# Altium project 724452_RPL-HX_Mobile_AEP_Rev0p91.PrjPcb (part 9 of 13)

## Sheet 0062_HDMI0_CONNECTOR .SchDoc
size A3
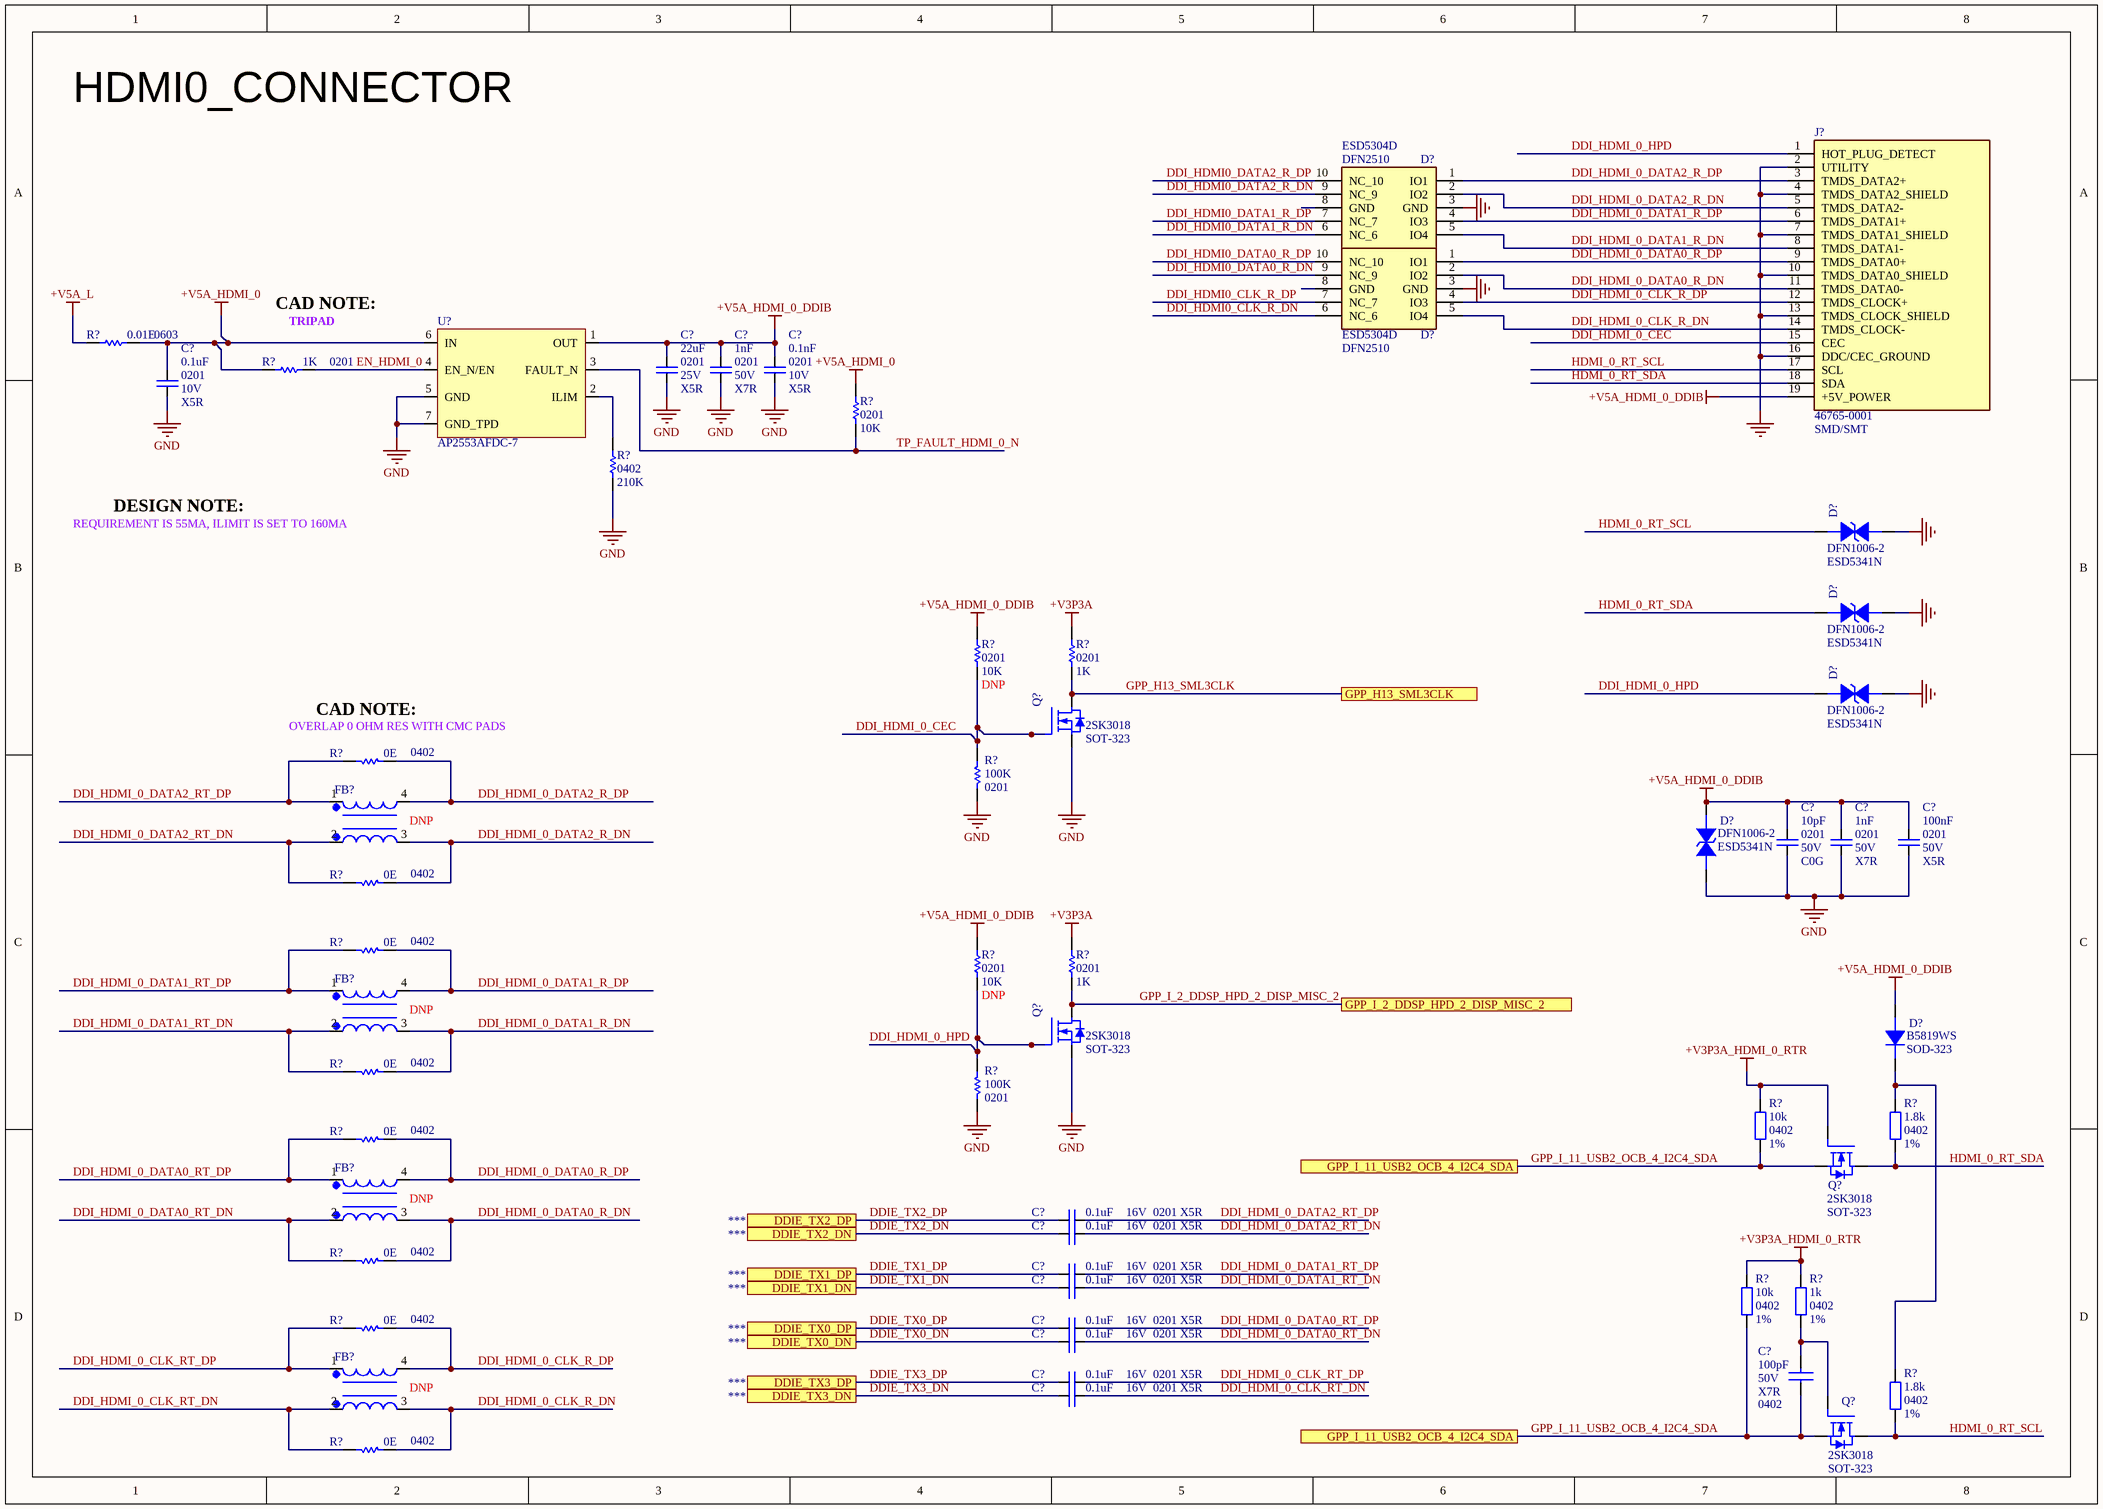
[diagram p102: 0062_HDMI0_CONNECTOR .SchDoc]

### Parts
(Parts that share a designator on the sheet are numbered #1, #2 ... from top to bottom, then left to right.)
C?#163  value 22uF  Case/Package: 0201  Voltage: 25V  Dielectric: X5R  [CAPC0805]
C?#164  value 1nF  Case/Package: 0201  Voltage: 50V  Dielectric: X7R  [CAPC0201]
C?#165  value 0.1nF  Case/Package: 0201  Voltage: 10V  Dielectric: X5R  [CAPC0201]
C?#166  value 0.1uF  Case/Package: 0201  Voltage: 10V  Dielectric: X5R  [CAPC0201]
C?#167  value 10pF  Case/Package: 0201  Voltage: 50V  Dielectric: C0G  [CAPC0201]
C?#168  value 1nF  Case/Package: 0201  Voltage: 50V  Dielectric: X7R  [CAPC0201]
C?#169  value 100nF  Case/Package: 0201  Voltage: 50V  Dielectric: X5R  [CAPC0201]
C?#170  value 0.1uF  Case/Package: 0201  Voltage: 16V  Dielectric: X5R  [CAPC0201]
C?#171  value 0.1uF  Case/Package: 0201  Voltage: 16V  Dielectric: X5R  [CAPC0201]
C?#172  value 0.1uF  Case/Package: 0201  Voltage: 16V  Dielectric: X5R  [CAPC0201]
C?#173  value 0.1uF  Case/Package: 0201  Voltage: 16V  Dielectric: X5R  [CAPC0201]
C?#174  value 0.1uF  Case/Package: 0201  Voltage: 16V  Dielectric: X5R  [CAPC0201]
C?#175  value 0.1uF  Case/Package: 0201  Voltage: 16V  Dielectric: X5R  [CAPC0201]
C?#176  value 0.1uF  Case/Package: 0201  Voltage: 16V  Dielectric: X5R  [CAPC0201]
C?#177  value 0.1uF  Case/Package: 0201  Voltage: 16V  Dielectric: X5R  [CAPC0201]
C?#178  value 100pF  Voltage: 50V  Dielectric: X7R  Case/Package: 0402  [CAPC0402]
D?#3  Case/Package: DFN2510  [DFN2510-10]  (hidden comment: ESD5304D)
D?#4  Case/Package: DFN2510  [DFN2510-10]  (hidden comment: ESD5304D)
D?#5  Case/Package: DFN1006-2  [DFN-2_1.0X0.6]  (hidden comment: ESD5341N)
D?#6  Case/Package: DFN1006-2  [DFN-2_1.0X0.6]  (hidden comment: ESD5341N)
D?#7  Case/Package: DFN1006-2  [DFN-2_1.0X0.6]  (hidden comment: ESD5341N)
D?#8  Case/Package: DFN1006-2  [DFN-2_1.0X0.6]  (hidden comment: ESD5341N)
D?#9  Manufacturer Part Number: B5819WS  [SOD-323]  (hidden comment: DIODE_B5819WS)
FB?#6  WCM3216F2SF-900T04  [CHOKE]  (value not drawn)
FB?#7  WCM3216F2SF-900T04  [CHOKE]  (value not drawn)
FB?#8  WCM3216F2SF-900T04  [CHOKE]  (value not drawn)
FB?#9  WCM3216F2SF-900T04  [CHOKE]  (value not drawn)
J?#7  Manufacturer Part Number: 46765-0001  Case/Package: SMD/SMT  [HDMI MICRO]  (hidden comment: Micro HDMI Conn)
Q?#2  Manufacturer Part Number: 2SK3018  Case/Package: SOT-323  [SOT323]  (hidden comment: MOSFET N_2SK3018)
Q?#3  Manufacturer Part Number: 2SK3018  Case/Package: SOT-323  [SOT323]  (hidden comment: MOSFET N_2SK3018)
Q?#4  Manufacturer Part Number: 2SK3018  Case/Package: SOT-323  [SOT323]  (hidden comment: MOSFET N_2SK3018)
Q?#5  Manufacturer Part Number: 2SK3018  Case/Package: SOT-323  [SOT323]  (hidden comment: MOSFET N_2SK3018)
R?#307  value 0.01E  Case/Package: 0603  [RESC0603]  (hidden comment: Res)
R?#308  value 1K  Case/Package: 0201  [RESC0201]  (hidden comment: Res)
R?#309  value 10K  Case/Package: 0201  [RESC0201]  (hidden comment: Res)
R?#310  value 210K  Case/Package: 0402  [RESC0402]  (hidden comment: Res)
R?#311  value 10K  Case/Package: 0201  [RESC0201]  (hidden comment: Res)
R?#312  value 1K  Case/Package: 0201  [RESC0201]  (hidden comment: Res)
R?#313  value 0E  Case/Package: 0402  [RESC0402]  (hidden comment: Res)
R?#314  value 100K  Case/Package: 0201  [RESC0201]  (hidden comment: Res)
R?#315  value 0E  Case/Package: 0402  [RESC0402]  (hidden comment: Res)
R?#316  value 0E  Case/Package: 0402  [RESC0402]  (hidden comment: Res)
R?#317  value 10K  Case/Package: 0201  [RESC0201]  (hidden comment: Res)
R?#318  value 1K  Case/Package: 0201  [RESC0201]  (hidden comment: Res)
R?#319  value 0E  Case/Package: 0402  [RESC0402]  (hidden comment: Res)
R?#320  value 100K  Case/Package: 0201  [RESC0201]  (hidden comment: Res)
R?#321  value 10k  Case/Package: 0402  Tolerance: 1%  [RESC0402]
R?#322  value 1.8k  Case/Package: 0402  Tolerance: 1%  [RESC0402]
R?#323  value 0E  Case/Package: 0402  [RESC0402]  (hidden comment: Res)
R?#324  value 0E  Case/Package: 0402  [RESC0402]  (hidden comment: Res)
R?#325  value 10k  Case/Package: 0402  Tolerance: 1%  [RESC0402]
R?#326  value 1k  Case/Package: 0402  Tolerance: 1%  [RESC0402]
R?#327  value 0E  Case/Package: 0402  [RESC0402]  (hidden comment: Res)
R?#328  value 1.8k  Case/Package: 0402  Tolerance: 1%  [RESC0402]
R?#329  value 0E  Case/Package: 0402  [RESC0402]  (hidden comment: Res)
U?#5  AP2553AFDC-7

### Ports
DDIE_TX0_DN, DDIE_TX0_DP, DDIE_TX1_DN, DDIE_TX1_DP, DDIE_TX2_DN, DDIE_TX2_DP, DDIE_TX3_DN, DDIE_TX3_DP, GPP_H13_SML3CLK, GPP_I_2_DDSP_HPD_2_DISP_MISC_2, GPP_I_11_USB2_OCB_4_I2C4_SDA

### Nets
+V3P3A: R?#312.2 R?#318.2
+V3P3A_HDMI_0_RTR: Q?#4.1(GATE) R?#321.2 R?#325.2 R?#326.2
+V5A_HDMI_0: C?#166.2 R?#307.1 R?#308.2 R?#309.2 U?#5.6(IN)
+V5A_HDMI_0_DDIB: C?#163.1 C?#164.1 C?#165.1 C?#167.1 C?#168.1 C?#169.1 D?#8.2 D?#9.1(A) J?#7.19(+5V_POWER) R?#311.2 R?#317.2 U?#5.1(OUT)
+V5A_L: R?#307.2
GND: C?#163.2 C?#164.2 C?#165.2 C?#166.1 C?#167.2 C?#168.2 C?#169.2 D?#3.3(GND) D?#4.3(GND) D?#5.1 D?#6.1 D?#7.1 D?#8.1 J?#7.2(UTILITY) J?#7.4(TMDS_DATA2_SHIELD) J?#7.7(TMDS_DATA1_SHIELD) J?#7.10(TMDS_DATA0_SHIELD) J?#7.13(TMDS_CLOCK_SHIELD) J?#7.16(DDC/CEC_GROUND) Q?#2.2(SOURCE) Q?#3.2(SOURCE) R?#310.1 R?#314.1 R?#320.1 U?#5.5(GND) U?#5.7(GND_TPD)  [project net EXP_A_RX_4_DP]
DDI_HDMI0_CLK_R_DN: D?#4.6(NC_6)
DDI_HDMI0_CLK_R_DP: D?#4.7(NC_7)
DDI_HDMI0_DATA0_R_DN: D?#4.9(NC_9)
DDI_HDMI0_DATA0_R_DP: D?#4.10(NC_10)
DDI_HDMI0_DATA1_R_DN: D?#3.6(NC_6)
DDI_HDMI0_DATA1_R_DP: D?#3.7(NC_7)
DDI_HDMI0_DATA2_R_DN: D?#3.9(NC_9)
DDI_HDMI0_DATA2_R_DP: D?#3.10(NC_10)
DDI_HDMI_0_CEC: J?#7.15(CEC) Q?#2.1(GATE) R?#311.1 R?#314.2
DDI_HDMI_0_CLK_R_DN: D?#4.5(IO4) FB?#9.3 J?#7.14(TMDS_CLOCK-) R?#329.2
DDI_HDMI_0_CLK_R_DP: D?#4.4(IO3) FB?#9.4 J?#7.12(TMDS_CLOCK+) R?#327.2
DDI_HDMI_0_CLK_RT_DN: C?#177.2 FB?#9.2 R?#329.1
DDI_HDMI_0_CLK_RT_DP: C?#176.2 FB?#9.1 R?#327.1
DDI_HDMI_0_DATA0_R_DN: D?#4.2(IO2) FB?#8.3 J?#7.11(TMDS_DATA0-) R?#324.2
DDI_HDMI_0_DATA0_R_DP: D?#4.1(IO1) FB?#8.4 J?#7.9(TMDS_DATA0+) R?#323.2
DDI_HDMI_0_DATA0_RT_DN: C?#175.2 FB?#8.2 R?#324.1
DDI_HDMI_0_DATA0_RT_DP: C?#174.2 FB?#8.1 R?#323.1
DDI_HDMI_0_DATA1_R_DN: D?#3.5(IO4) FB?#7.3 J?#7.8(TMDS_DATA1-) R?#319.2
DDI_HDMI_0_DATA1_R_DP: D?#3.4(IO3) FB?#7.4 J?#7.6(TMDS_DATA1+) R?#316.2
DDI_HDMI_0_DATA1_RT_DN: C?#173.2 FB?#7.2 R?#319.1
DDI_HDMI_0_DATA1_RT_DP: C?#172.2 FB?#7.1 R?#316.1
DDI_HDMI_0_DATA2_R_DN: D?#3.2(IO2) FB?#6.3 J?#7.5(TMDS_DATA2-) R?#315.2
DDI_HDMI_0_DATA2_R_DP: D?#3.1(IO1) FB?#6.4 J?#7.3(TMDS_DATA2+) R?#313.2
DDI_HDMI_0_DATA2_RT_DN: C?#171.2 FB?#6.2 R?#315.1
DDI_HDMI_0_DATA2_RT_DP: C?#170.2 FB?#6.1 R?#313.1
DDI_HDMI_0_HPD: D?#7.2 J?#7.1(HOT_PLUG_DETECT) Q?#3.1(GATE) R?#317.1 R?#320.2
DDIE_TX0_DN: C?#175.1 ; port DDIE_TX0_DN
DDIE_TX0_DP: C?#174.1 ; port DDIE_TX0_DP
DDIE_TX1_DN: C?#173.1 ; port DDIE_TX1_DN
DDIE_TX1_DP: C?#172.1 ; port DDIE_TX1_DP
DDIE_TX2_DN: C?#171.1 ; port DDIE_TX2_DN
DDIE_TX2_DP: C?#170.1 ; port DDIE_TX2_DP
DDIE_TX3_DN: C?#177.1 ; port DDIE_TX3_DN
DDIE_TX3_DP: C?#176.1 ; port DDIE_TX3_DP
EN_HDMI_0: R?#308.1 U?#5.4(EN_N/EN)
GPP_H13_SML3CLK: Q?#2.3(DRAIN) R?#312.1 ; port GPP_H13_SML3CLK
GPP_I_2_DDSP_HPD_2_DISP_MISC_2: Q?#3.3(DRAIN) R?#318.1 ; port GPP_I_2_DDSP_HPD_2_DISP_MISC_2
GPP_I_11_USB2_OCB_4_I2C4_SDA: C?#178.1 Q?#4.2(SOURCE) Q?#5.2(SOURCE) R?#321.1 R?#325.1 ; port GPP_I_11_USB2_OCB_4_I2C4_SDA
HDMI_0_RT_SCL: D?#5.2 J?#7.17(SCL) Q?#5.3(DRAIN) R?#328.1
HDMI_0_RT_SDA: D?#6.2 J?#7.18(SDA) Q?#4.3(DRAIN) R?#322.1
TP_FAULT_HDMI_0_N: R?#309.1 U?#5.3(FAULT_N)
NetC?#178_2: C?#178.2 Q?#5.1(GATE) R?#326.1
NetD?#9_2: D?#9.2(K) R?#322.2 R?#328.2
NetR?#310_2: R?#310.2 U?#5.2(ILIM)

Not connected (* = marked no-connect by the designer): D?#3 8(GND); D?#4 8(GND)

### Notes on the sheet
- HDMI0_CONNECTOR
- CAD NOTE:
- (near R?#308) TRIPAD
- DESIGN NOTE:
- REQUIREMENT IS 55MA, ILIMIT IS SET TO 160MA
- (near R?#313) CAD NOTE:
- (near R?#313) OVERLAP 0 OHM RES WITH CMC PADS

### Library data of the parts
C?#163 = Cap: CAP CER 22uF 25V X5R 0805
C?#164 C?#168 = Cap: CAP CER 1nF 50V X7R 0201
C?#165 = Cap: CAP CER 0.1nF 10V X5R 0201
C?#166 = Cap: CAP CER 0.1uF 10V X5R 0201
C?#167 = Cap: CAP CER 10pF 50V C0G 0201
C?#169 = Cap: CAP CER 100nF 50V X5R 0201
C?#170-C?#177 = Cap: CAP CER 0.1uF 16V X5R 0201
C?#178 = Cap: CAP CER 100pF 50V X7R 0402; Manufacturer Part Number: *
D?#3 D?#4 = ESD5304D: 4-Lines, Uni-directional, Ultra-low Capacitance Transient Voltage Suppressors; Manufacturer Part Number: ESD5304D
D?#5-D?#8 = ESD5341N: 1-Line, Bi-directional, Transient Voltage Suppressors.1pF.; Manufacturer Part Number: ESD5341N
D?#9 = DIODE_B5819WS: Schottky Barrier£¬B5819WS SOD-323; Case/Package: SOD-323
FB?#6-FB?#9 = WCM3216F2SF-900T04: Power, Signal Line 90 Ohms @ 100MHz 300 mOhm 50V SMD,3.2x1.6x2mm Common Mode Filters RoHS; Manufacturer Part Number: WCM3216F2SF-900T04; Case/Package: 3.2x1.6x2mm; DNP: DNP
J?#7 = Micro HDMI Conn: HDMI - Micro Receptacle Connector 19 Position Surface Mount, Right Angle
Q?#2-Q?#5 = MOSFET N_2SK3018: NMOS,2SK3018,SOT_323,Id=0.1A,Vds=30V
R?#307 = Res: Thick Film Resistor -  0.01ohm, 1%, 0603
R?#308 R?#312 R?#318 = Res: Thick Film Resistor -  1Kohm, 1%, 0201
R?#309 R?#311 R?#317 = Res: Thick Film Resistor -  10Kohm, 1%, 0201
  R?#311 R?#317: DNP: DNP
R?#310 = Res: Thick Film Resistor -  210Kohm, 1%, 0402
R?#313 R?#315 R?#316 R?#319 R?#323 R?#324 R?#327 R?#329 = Res: Thick Film Resistor -  0ohm, 1%, 0402
R?#314 R?#320 = Res: Thick Film Resistor -  100Kohm, 1%, 0201
R?#321 R?#325 = RES: Thick Film Resistor - 10k ohm, 1%, 0402; Manufacturer Part Number: *
R?#322 R?#328 = RES: Thick Film Resistor - 1.8k ohm, 1%, 0402; Manufacturer Part Number: *
R?#326 = RES: Thick Film Resistor - 1k ohm, 1%, 0402; Manufacturer Part Number: *

## Sheet 0063_HDMI1_CONNECTOR.SchDoc
size A3
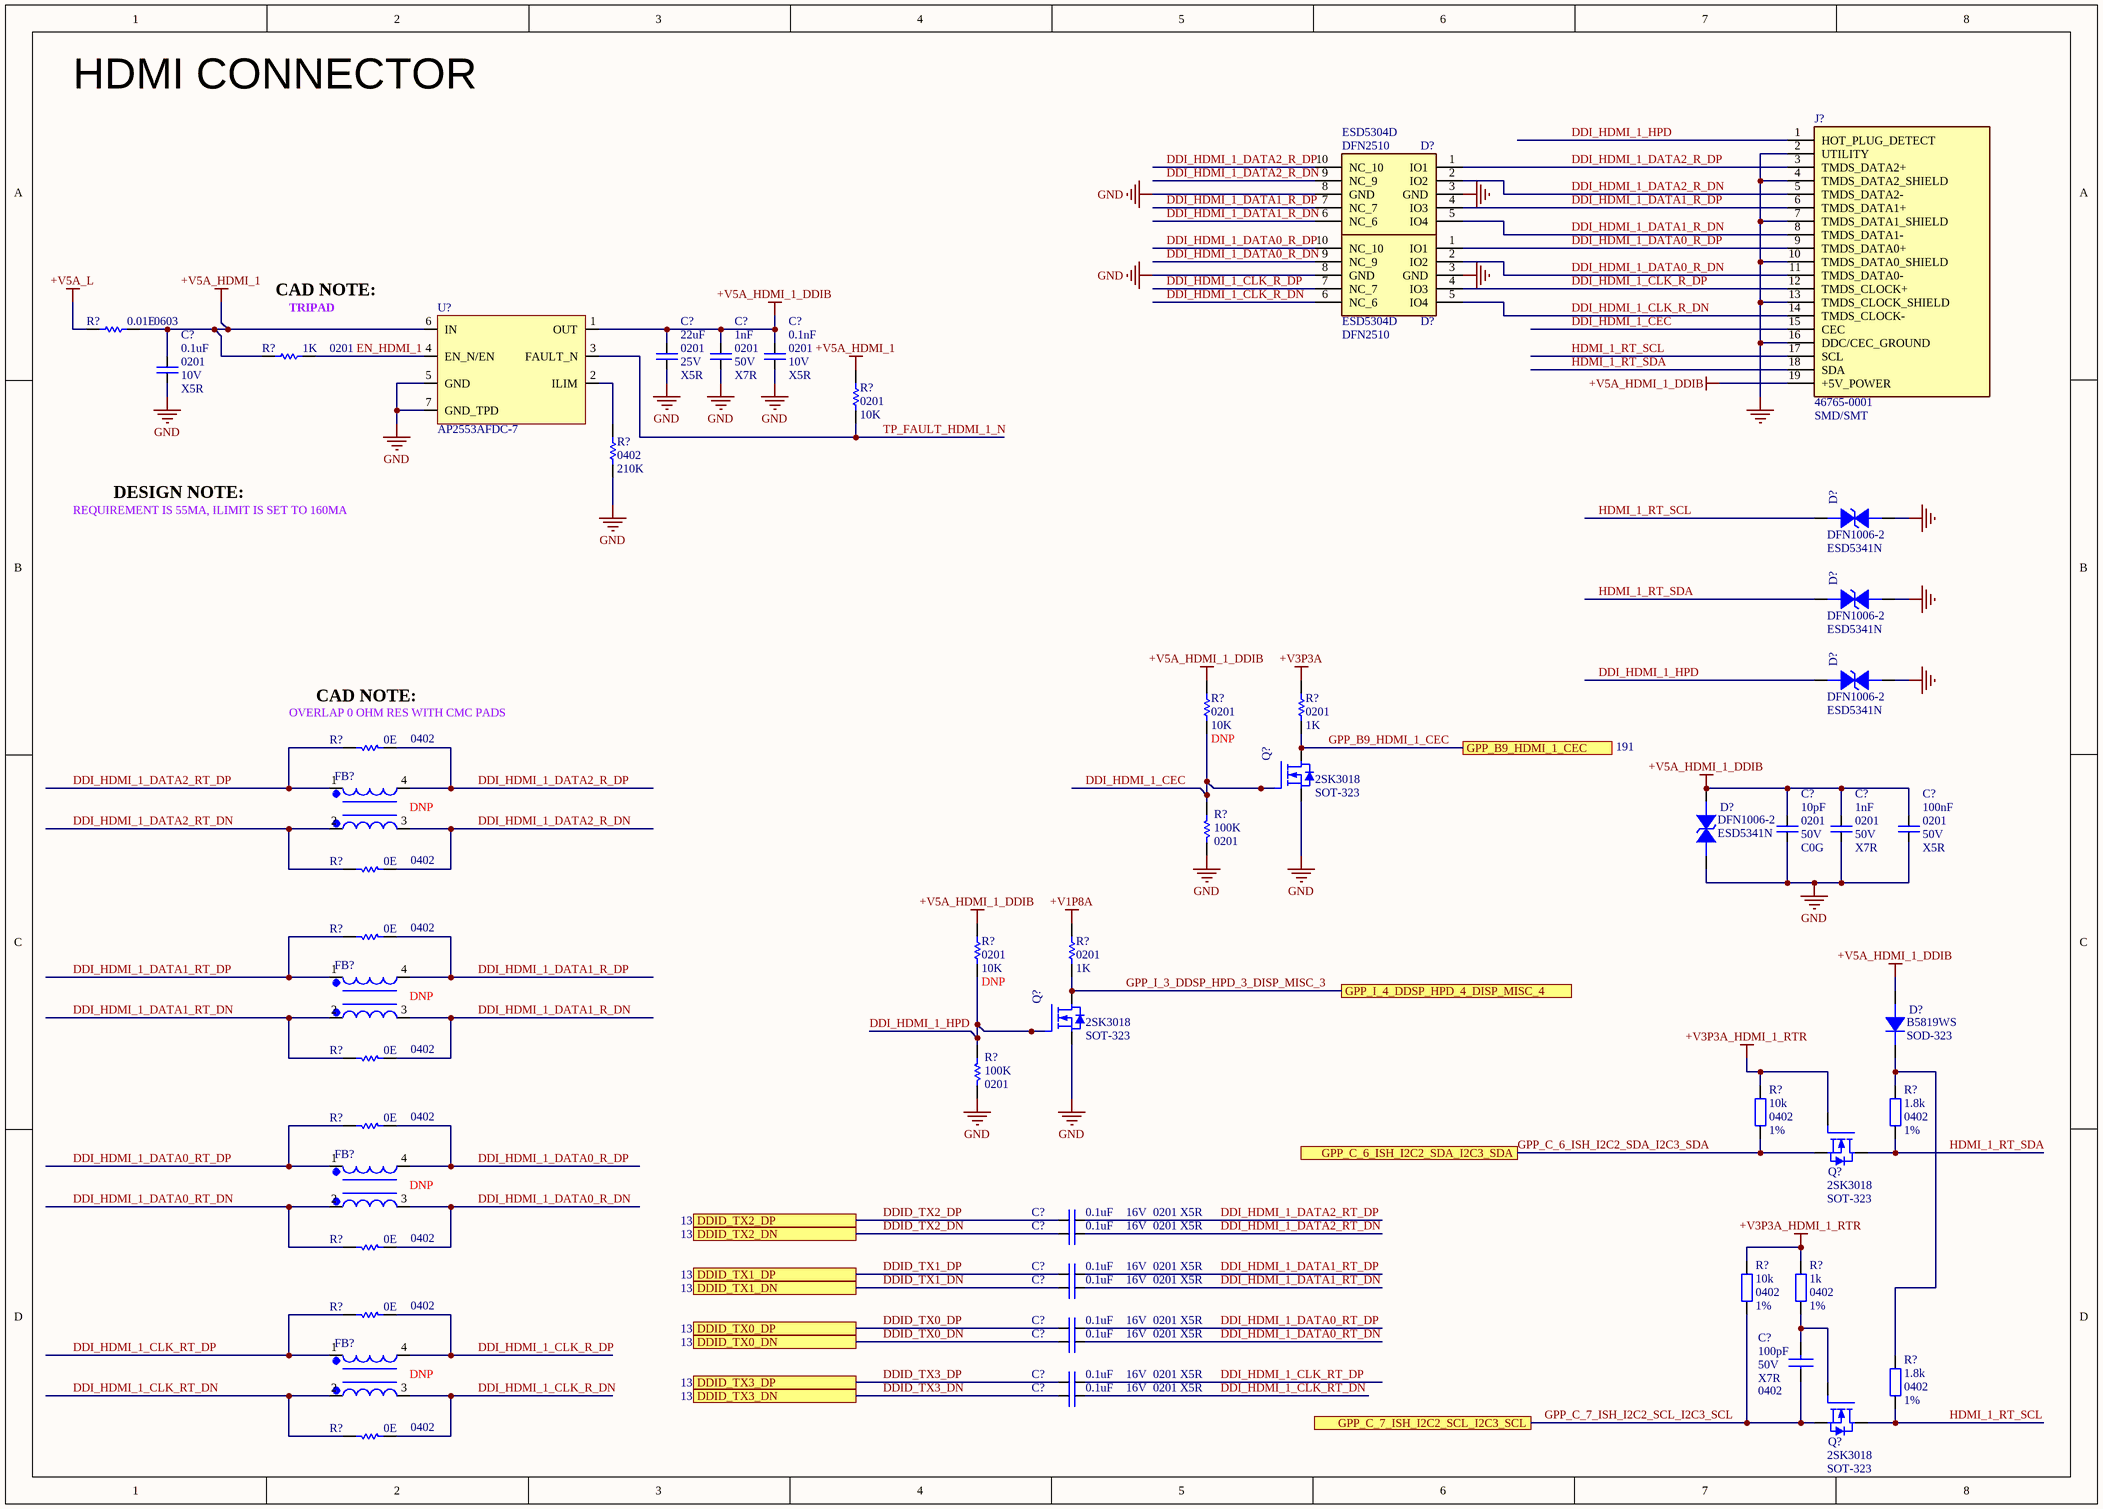
[diagram p103: 0063_HDMI1_CONNECTOR.SchDoc]

### Parts
(Parts that share a designator on the sheet are numbered #1, #2 ... from top to bottom, then left to right.)
C?#179  value 22uF  Case/Package: 0201  Voltage: 25V  Dielectric: X5R  [CAPC0805]
C?#180  value 1nF  Case/Package: 0201  Voltage: 50V  Dielectric: X7R  [CAPC0201]
C?#181  value 0.1nF  Case/Package: 0201  Voltage: 10V  Dielectric: X5R  [CAPC0201]
C?#182  value 0.1uF  Case/Package: 0201  Voltage: 10V  Dielectric: X5R  [CAPC0201]
C?#183  value 10pF  Case/Package: 0201  Voltage: 50V  Dielectric: C0G  [CAPC0201]
C?#184  value 1nF  Case/Package: 0201  Voltage: 50V  Dielectric: X7R  [CAPC0201]
C?#185  value 100nF  Case/Package: 0201  Voltage: 50V  Dielectric: X5R  [CAPC0201]
C?#186  value 0.1uF  Case/Package: 0201  Voltage: 16V  Dielectric: X5R  [CAPC0201]
C?#187  value 0.1uF  Case/Package: 0201  Voltage: 16V  Dielectric: X5R  [CAPC0201]
C?#188  value 0.1uF  Case/Package: 0201  Voltage: 16V  Dielectric: X5R  [CAPC0201]
C?#189  value 0.1uF  Case/Package: 0201  Voltage: 16V  Dielectric: X5R  [CAPC0201]
C?#190  value 0.1uF  Case/Package: 0201  Voltage: 16V  Dielectric: X5R  [CAPC0201]
C?#191  value 0.1uF  Case/Package: 0201  Voltage: 16V  Dielectric: X5R  [CAPC0201]
C?#192  value 0.1uF  Case/Package: 0201  Voltage: 16V  Dielectric: X5R  [CAPC0201]
C?#193  value 100pF  Voltage: 50V  Dielectric: X7R  Case/Package: 0402  [CAPC0402]
C?#194  value 0.1uF  Case/Package: 0201  Voltage: 16V  Dielectric: X5R  [CAPC0201]
D?#10  Case/Package: DFN2510  [DFN2510-10]  (hidden comment: ESD5304D)
D?#11  Case/Package: DFN2510  [DFN2510-10]  (hidden comment: ESD5304D)
D?#12  Case/Package: DFN1006-2  [DFN-2_1.0X0.6]  (hidden comment: ESD5341N)
D?#13  Case/Package: DFN1006-2  [DFN-2_1.0X0.6]  (hidden comment: ESD5341N)
D?#14  Case/Package: DFN1006-2  [DFN-2_1.0X0.6]  (hidden comment: ESD5341N)
D?#15  Case/Package: DFN1006-2  [DFN-2_1.0X0.6]  (hidden comment: ESD5341N)
D?#16  Manufacturer Part Number: B5819WS  [SOD-323]  (hidden comment: DIODE_B5819WS)
FB?#10  WCM3216F2SF-900T04  [CHOKE]  (value not drawn)
FB?#11  WCM3216F2SF-900T04  [CHOKE]  (value not drawn)
FB?#12  WCM3216F2SF-900T04  [CHOKE]  (value not drawn)
FB?#13  WCM3216F2SF-900T04  [CHOKE]  (value not drawn)
J?#8  Manufacturer Part Number: 46765-0001  Case/Package: SMD/SMT  [HDMI MICRO]  (hidden comment: Micro HDMI Conn)
Q?#6  Manufacturer Part Number: 2SK3018  Case/Package: SOT-323  [SOT323]  (hidden comment: MOSFET N_2SK3018)
Q?#7  Manufacturer Part Number: 2SK3018  Case/Package: SOT-323  [SOT323]  (hidden comment: MOSFET N_2SK3018)
Q?#8  Manufacturer Part Number: 2SK3018  Case/Package: SOT-323  [SOT323]  (hidden comment: MOSFET N_2SK3018)
Q?#9  Manufacturer Part Number: 2SK3018  Case/Package: SOT-323  [SOT323]  (hidden comment: MOSFET N_2SK3018)
R?#330  value 0.01E  Case/Package: 0603  [RESC0603]  (hidden comment: Res)
R?#331  value 1K  Case/Package: 0201  [RESC0201]  (hidden comment: Res)
R?#332  value 10K  Case/Package: 0201  [RESC0201]  (hidden comment: Res)
R?#333  value 210K  Case/Package: 0402  [RESC0402]  (hidden comment: Res)
R?#334  value 10K  Case/Package: 0201  [RESC0201]  (hidden comment: Res)
R?#335  value 1K  Case/Package: 0201  [RESC0201]  (hidden comment: Res)
R?#336  value 0E  Case/Package: 0402  [RESC0402]  (hidden comment: Res)
R?#337  value 100K  Case/Package: 0201  [RESC0201]  (hidden comment: Res)
R?#338  value 0E  Case/Package: 0402  [RESC0402]  (hidden comment: Res)
R?#339  value 0E  Case/Package: 0402  [RESC0402]  (hidden comment: Res)
R?#340  value 10K  Case/Package: 0201  [RESC0201]  (hidden comment: Res)
R?#341  value 1K  Case/Package: 0201  [RESC0201]  (hidden comment: Res)
R?#342  value 0E  Case/Package: 0402  [RESC0402]  (hidden comment: Res)
R?#343  value 100K  Case/Package: 0201  [RESC0201]  (hidden comment: Res)
R?#344  value 10k  Case/Package: 0402  Tolerance: 1%  [RESC0402]
R?#345  value 1.8k  Case/Package: 0402  Tolerance: 1%  [RESC0402]
R?#346  value 0E  Case/Package: 0402  [RESC0402]  (hidden comment: Res)
R?#347  value 0E  Case/Package: 0402  [RESC0402]  (hidden comment: Res)
R?#348  value 10k  Case/Package: 0402  Tolerance: 1%  [RESC0402]
R?#349  value 1k  Case/Package: 0402  Tolerance: 1%  [RESC0402]
R?#350  value 0E  Case/Package: 0402  [RESC0402]  (hidden comment: Res)
R?#351  value 1.8k  Case/Package: 0402  Tolerance: 1%  [RESC0402]
R?#352  value 0E  Case/Package: 0402  [RESC0402]  (hidden comment: Res)
U?#6  AP2553AFDC-7

### Ports
DDID_TX0_DN, DDID_TX0_DP, DDID_TX1_DN, DDID_TX1_DP, DDID_TX2_DN, DDID_TX2_DP, DDID_TX3_DN, DDID_TX3_DP, GPP_B9_HDMI_1_CEC, GPP_C_6_ISH_I2C2_SDA_I2C3_SDA, GPP_C_7_ISH_I2C2_SCL_I2C3_SCL, GPP_I_4_DDSP_HPD_4_DISP_MISC_4

### Nets
+V1P8A: R?#341.2
+V3P3A: R?#335.2
+V3P3A_HDMI_1_RTR: Q?#8.1(GATE) R?#344.2 R?#348.2 R?#349.2
+V5A_HDMI_1: C?#182.2 R?#330.1 R?#331.2 R?#332.2 U?#6.6(IN)
+V5A_HDMI_1_DDIB: C?#179.1 C?#180.1 C?#181.1 C?#183.1 C?#184.1 C?#185.1 D?#15.2 D?#16.1(A) J?#8.19(+5V_POWER) R?#334.2 R?#340.2 U?#6.1(OUT)
+V5A_L: R?#330.2
GND: C?#179.2 C?#180.2 C?#181.2 C?#182.1 C?#183.2 C?#184.2 C?#185.2 D?#10.3(GND) D?#10.8(GND) D?#11.3(GND) D?#11.8(GND) D?#12.1 D?#13.1 D?#14.1 D?#15.1 J?#8.2(UTILITY) J?#8.4(TMDS_DATA2_SHIELD) J?#8.7(TMDS_DATA1_SHIELD) J?#8.10(TMDS_DATA0_SHIELD) J?#8.13(TMDS_CLOCK_SHIELD) J?#8.16(DDC/CEC_GROUND) Q?#6.2(SOURCE) Q?#7.2(SOURCE) R?#333.1 R?#337.1 R?#343.1 U?#6.5(GND) U?#6.7(GND_TPD)  [project net EXP_A_RX_4_DP]
DDI_HDMI_1_CEC: J?#8.15(CEC) Q?#6.1(GATE) R?#334.1 R?#337.2
DDI_HDMI_1_CLK_R_DN: D?#11.5(IO4) D?#11.6(NC_6) FB?#13.3 J?#8.14(TMDS_CLOCK-) R?#352.2
DDI_HDMI_1_CLK_R_DP: D?#11.4(IO3) D?#11.7(NC_7) FB?#13.4 J?#8.12(TMDS_CLOCK+) R?#350.2
DDI_HDMI_1_CLK_RT_DN: C?#194.2 FB?#13.2 R?#352.1
DDI_HDMI_1_CLK_RT_DP: C?#192.2 FB?#13.1 R?#350.1
DDI_HDMI_1_DATA0_R_DN: D?#11.2(IO2) D?#11.9(NC_9) FB?#12.3 J?#8.11(TMDS_DATA0-) R?#347.2
DDI_HDMI_1_DATA0_R_DP: D?#11.1(IO1) D?#11.10(NC_10) FB?#12.4 J?#8.9(TMDS_DATA0+) R?#346.2
DDI_HDMI_1_DATA0_RT_DN: C?#191.2 FB?#12.2 R?#347.1
DDI_HDMI_1_DATA0_RT_DP: C?#190.2 FB?#12.1 R?#346.1
DDI_HDMI_1_DATA1_R_DN: D?#10.5(IO4) D?#10.6(NC_6) FB?#11.3 J?#8.8(TMDS_DATA1-) R?#342.2
DDI_HDMI_1_DATA1_R_DP: D?#10.4(IO3) D?#10.7(NC_7) FB?#11.4 J?#8.6(TMDS_DATA1+) R?#339.2
DDI_HDMI_1_DATA1_RT_DN: C?#189.2 FB?#11.2 R?#342.1
DDI_HDMI_1_DATA1_RT_DP: C?#188.2 FB?#11.1 R?#339.1
DDI_HDMI_1_DATA2_R_DN: D?#10.2(IO2) D?#10.9(NC_9) FB?#10.3 J?#8.5(TMDS_DATA2-) R?#338.2
DDI_HDMI_1_DATA2_R_DP: D?#10.1(IO1) D?#10.10(NC_10) FB?#10.4 J?#8.3(TMDS_DATA2+) R?#336.2
DDI_HDMI_1_DATA2_RT_DN: C?#187.2 FB?#10.2 R?#338.1
DDI_HDMI_1_DATA2_RT_DP: C?#186.2 FB?#10.1 R?#336.1
DDI_HDMI_1_HPD: D?#14.2 J?#8.1(HOT_PLUG_DETECT) Q?#7.1(GATE) R?#340.1 R?#343.2
DDID_TX0_DN: C?#191.1 ; port DDID_TX0_DN
DDID_TX0_DP: C?#190.1 ; port DDID_TX0_DP
DDID_TX1_DN: C?#189.1 ; port DDID_TX1_DN
DDID_TX1_DP: C?#188.1 ; port DDID_TX1_DP
DDID_TX2_DN: C?#187.1 ; port DDID_TX2_DN
DDID_TX2_DP: C?#186.1 ; port DDID_TX2_DP
DDID_TX3_DN: C?#194.1 ; port DDID_TX3_DN
DDID_TX3_DP: C?#192.1 ; port DDID_TX3_DP
EN_HDMI_1: R?#331.1 U?#6.4(EN_N/EN)
GPP_B9_HDMI_1_CEC: Q?#6.3(DRAIN) R?#335.1 ; port GPP_B9_HDMI_1_CEC
GPP_C_6_ISH_I2C2_SDA_I2C3_SDA: Q?#8.2(SOURCE) R?#344.1 ; port GPP_C_6_ISH_I2C2_SDA_I2C3_SDA
GPP_C_7_ISH_I2C2_SCL_I2C3_SCL: C?#193.1 Q?#9.2(SOURCE) R?#348.1 ; port GPP_C_7_ISH_I2C2_SCL_I2C3_SCL
GPP_I_3_DDSP_HPD_3_DISP_MISC_3: Q?#7.3(DRAIN) R?#341.1 ; port GPP_I_4_DDSP_HPD_4_DISP_MISC_4
HDMI_1_RT_SCL: D?#12.2 J?#8.17(SCL) Q?#9.3(DRAIN) R?#351.1
HDMI_1_RT_SDA: D?#13.2 J?#8.18(SDA) Q?#8.3(DRAIN) R?#345.1
TP_FAULT_HDMI_1_N: R?#332.1 U?#6.3(FAULT_N)
NetC?#193_2: C?#193.2 Q?#9.1(GATE) R?#349.1
NetD?#16_2: D?#16.2(K) R?#345.2 R?#351.2
NetR?#333_2: R?#333.2 U?#6.2(ILIM)

### Notes on the sheet
- HDMI CONNECTOR
- CAD NOTE:
- (near R?#331) TRIPAD
- REQUIREMENT IS 55MA, ILIMIT IS SET TO 160MA
- DESIGN NOTE:
- (near R?#336) OVERLAP 0 OHM RES WITH CMC PADS
- (near R?#336) CAD NOTE:

### Library data of the parts
C?#179 = Cap: CAP CER 22uF 25V X5R 0805
C?#180 C?#184 = Cap: CAP CER 1nF 50V X7R 0201
C?#181 = Cap: CAP CER 0.1nF 10V X5R 0201
C?#182 = Cap: CAP CER 0.1uF 10V X5R 0201
C?#183 = Cap: CAP CER 10pF 50V C0G 0201
C?#185 = Cap: CAP CER 100nF 50V X5R 0201
C?#186-C?#192 C?#194 = Cap: CAP CER 0.1uF 16V X5R 0201
C?#193 = Cap: CAP CER 100pF 50V X7R 0402; Manufacturer Part Number: *
D?#10 D?#11 = ESD5304D: as D?#3 on sheet 0062_HDMI0_CONNECTOR ; Manufacturer Part Number: ESD5304D
D?#12-D?#15 = ESD5341N: as D?#5 on sheet 0062_HDMI0_CONNECTOR ; Manufacturer Part Number: ESD5341N
D?#16 = DIODE_B5819WS: Schottky Barrier£¬B5819WS SOD-323; Case/Package: SOD-323
FB?#10-FB?#13 = WCM3216F2SF-900T04: as FB?#6-FB?#9 on sheet 0062_HDMI0_CONNECTOR ; Manufacturer Part Number: WCM3216F2SF-900T04; Case/Package: 3.2x1.6x2mm; DNP: DNP
J?#8 = Micro HDMI Conn: as J?#7 on sheet 0062_HDMI0_CONNECTOR 
Q?#6-Q?#9 = MOSFET N_2SK3018: NMOS,2SK3018,SOT_323,Id=0.1A,Vds=30V
R?#330 = Res: Thick Film Resistor -  0.01ohm, 1%, 0603
R?#331 R?#335 R?#341 = Res: Thick Film Resistor -  1Kohm, 1%, 0201
R?#332 R?#334 R?#340 = Res: Thick Film Resistor -  10Kohm, 1%, 0201
  R?#334 R?#340: DNP: DNP
R?#333 = Res: Thick Film Resistor -  210Kohm, 1%, 0402
R?#336 R?#338 R?#339 R?#342 R?#346 R?#347 R?#350 R?#352 = Res: Thick Film Resistor -  0ohm, 1%, 0402
R?#337 R?#343 = Res: Thick Film Resistor -  100Kohm, 1%, 0201
R?#344 R?#348 = RES: Thick Film Resistor - 10k ohm, 1%, 0402; Manufacturer Part Number: *
R?#345 R?#351 = RES: Thick Film Resistor - 1.8k ohm, 1%, 0402; Manufacturer Part Number: *
R?#349 = RES: Thick Film Resistor - 1k ohm, 1%, 0402; Manufacturer Part Number: *

## Sheet 0071_HSIO MUXING -2.SchDoc
size 848 x 558 mm
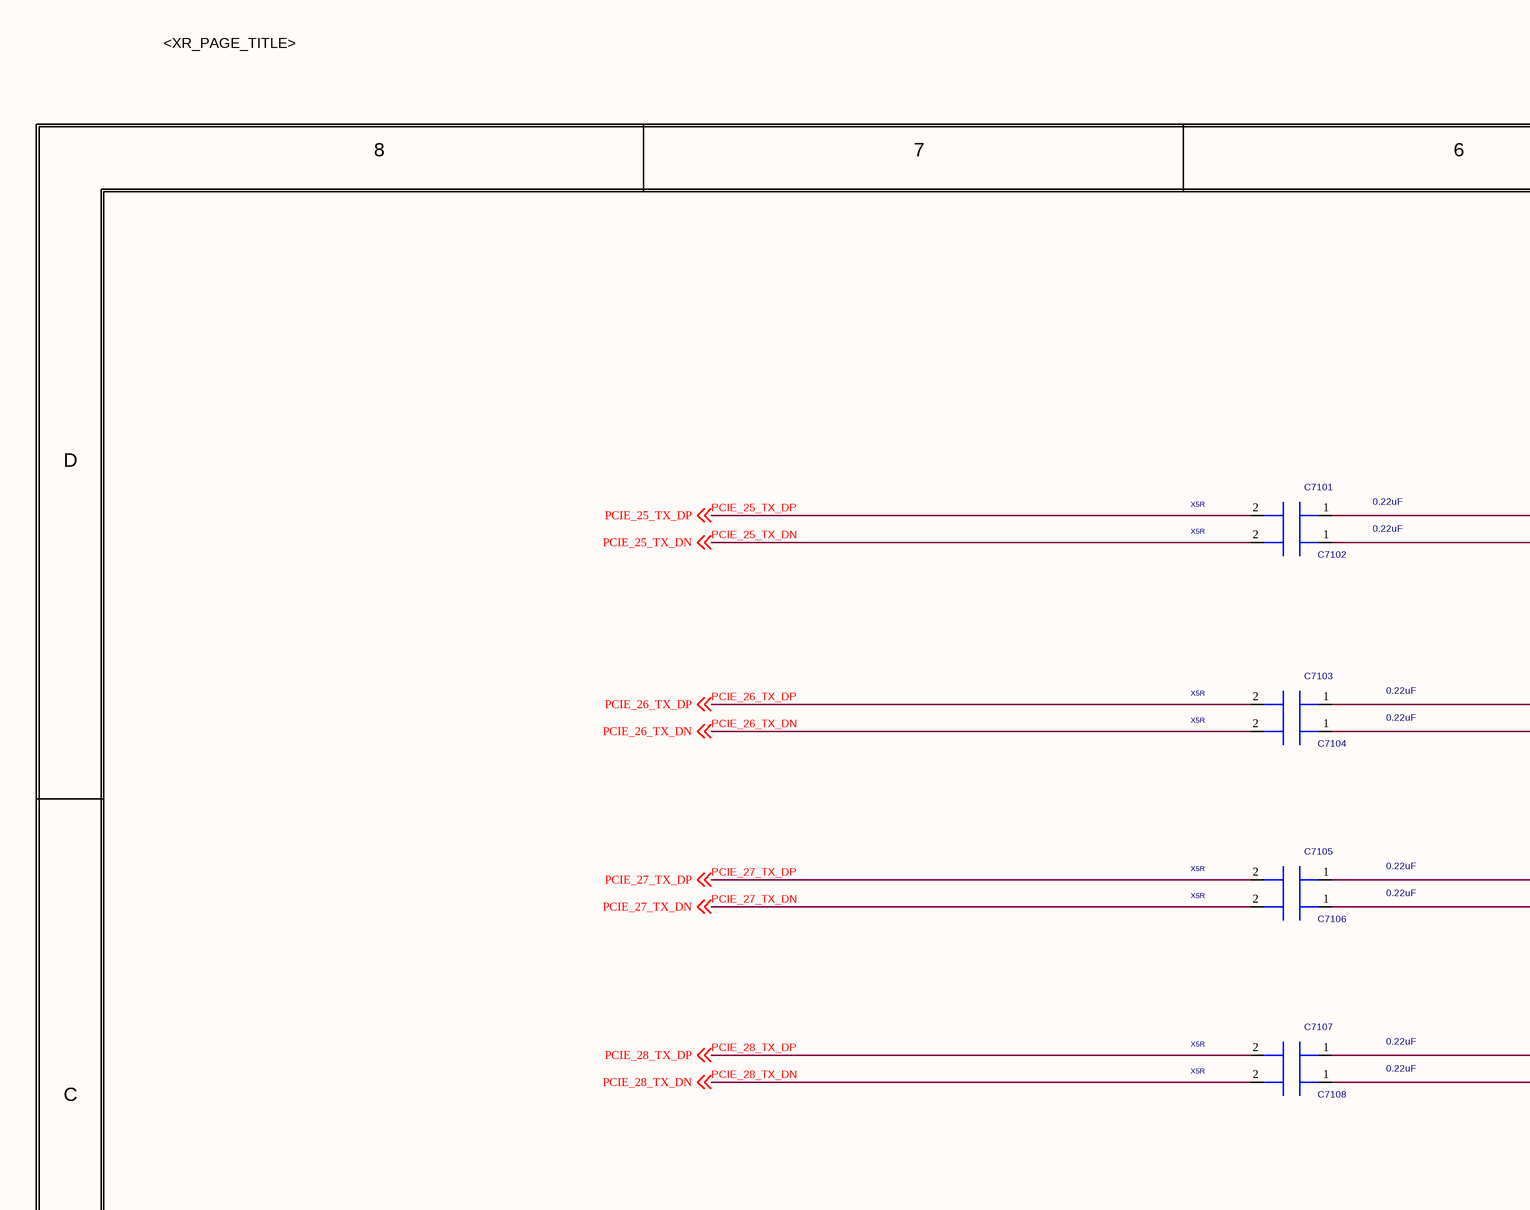
[diagram p104: 0071_HSIO MUXING -2.SchDoc, top left]
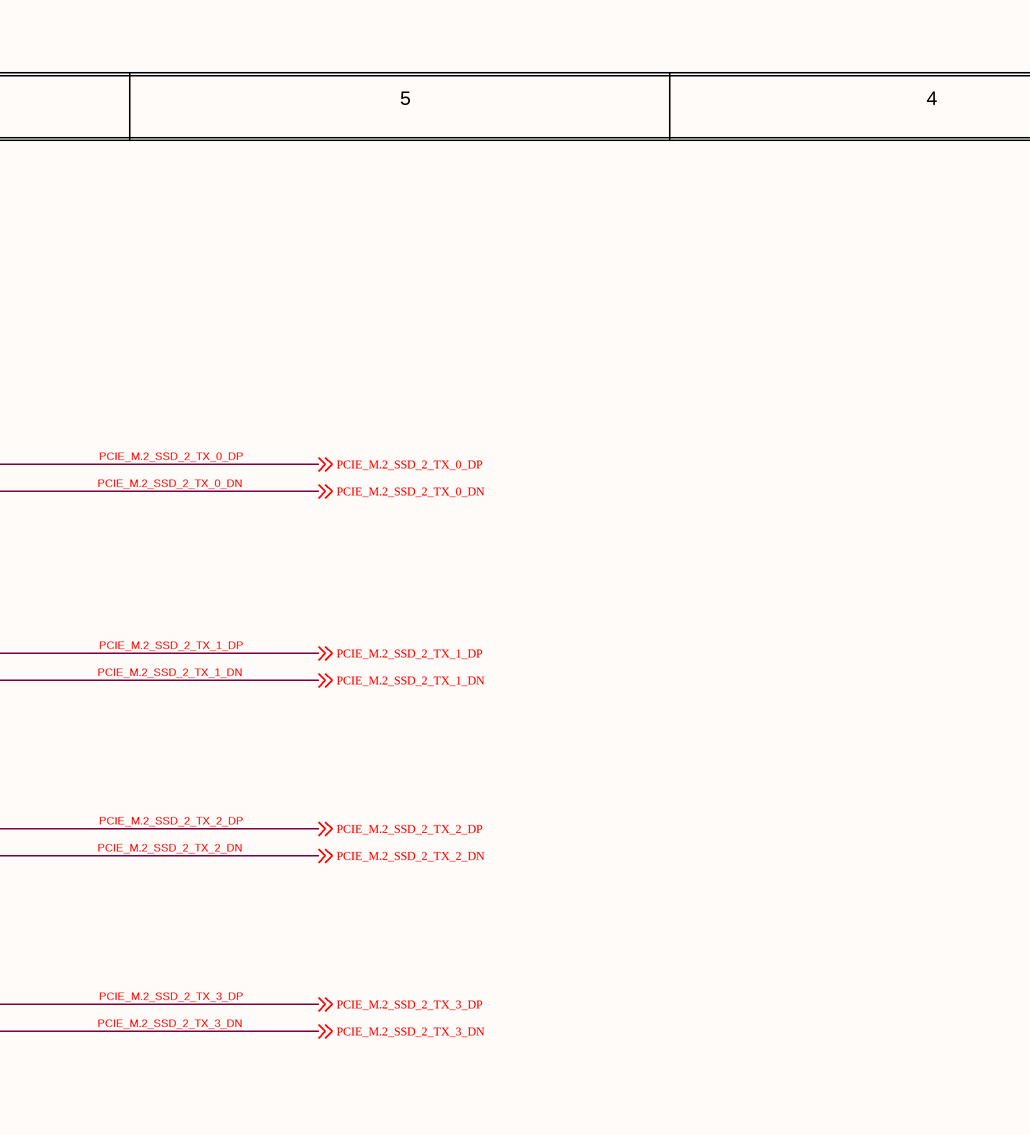
[diagram p105: 0071_HSIO MUXING -2.SchDoc, top middle]
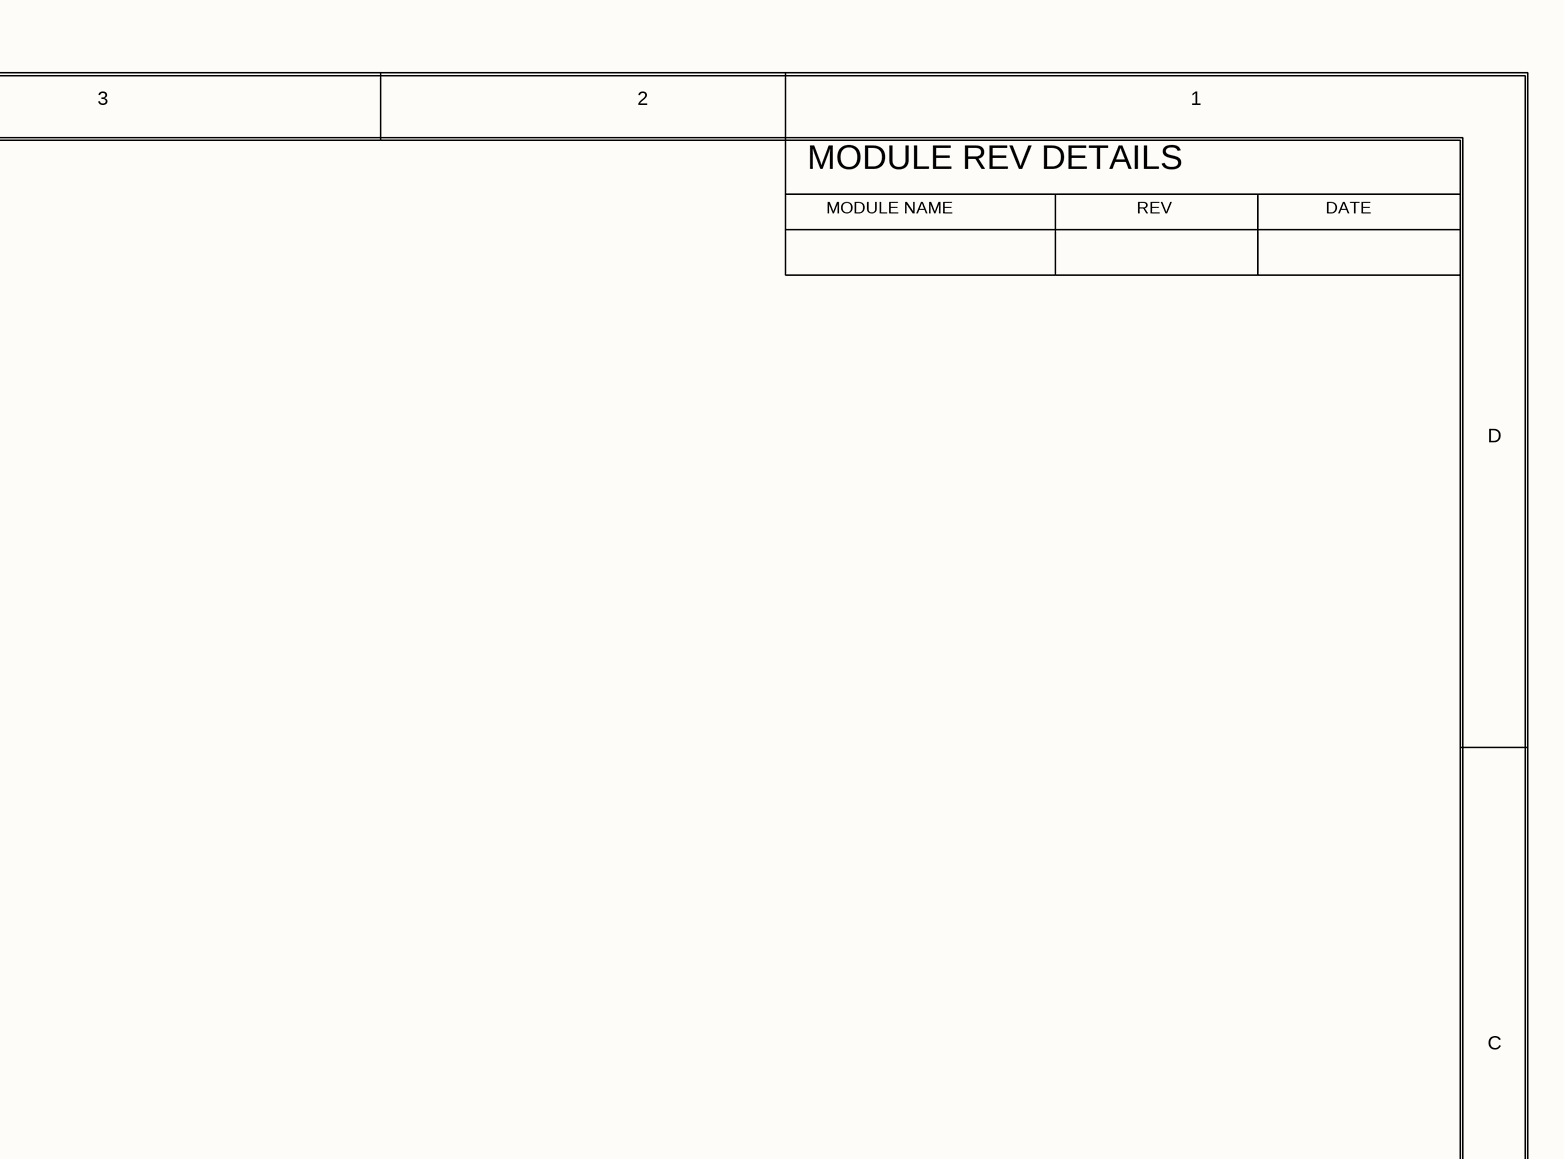
[diagram p106: 0071_HSIO MUXING -2.SchDoc, top right]
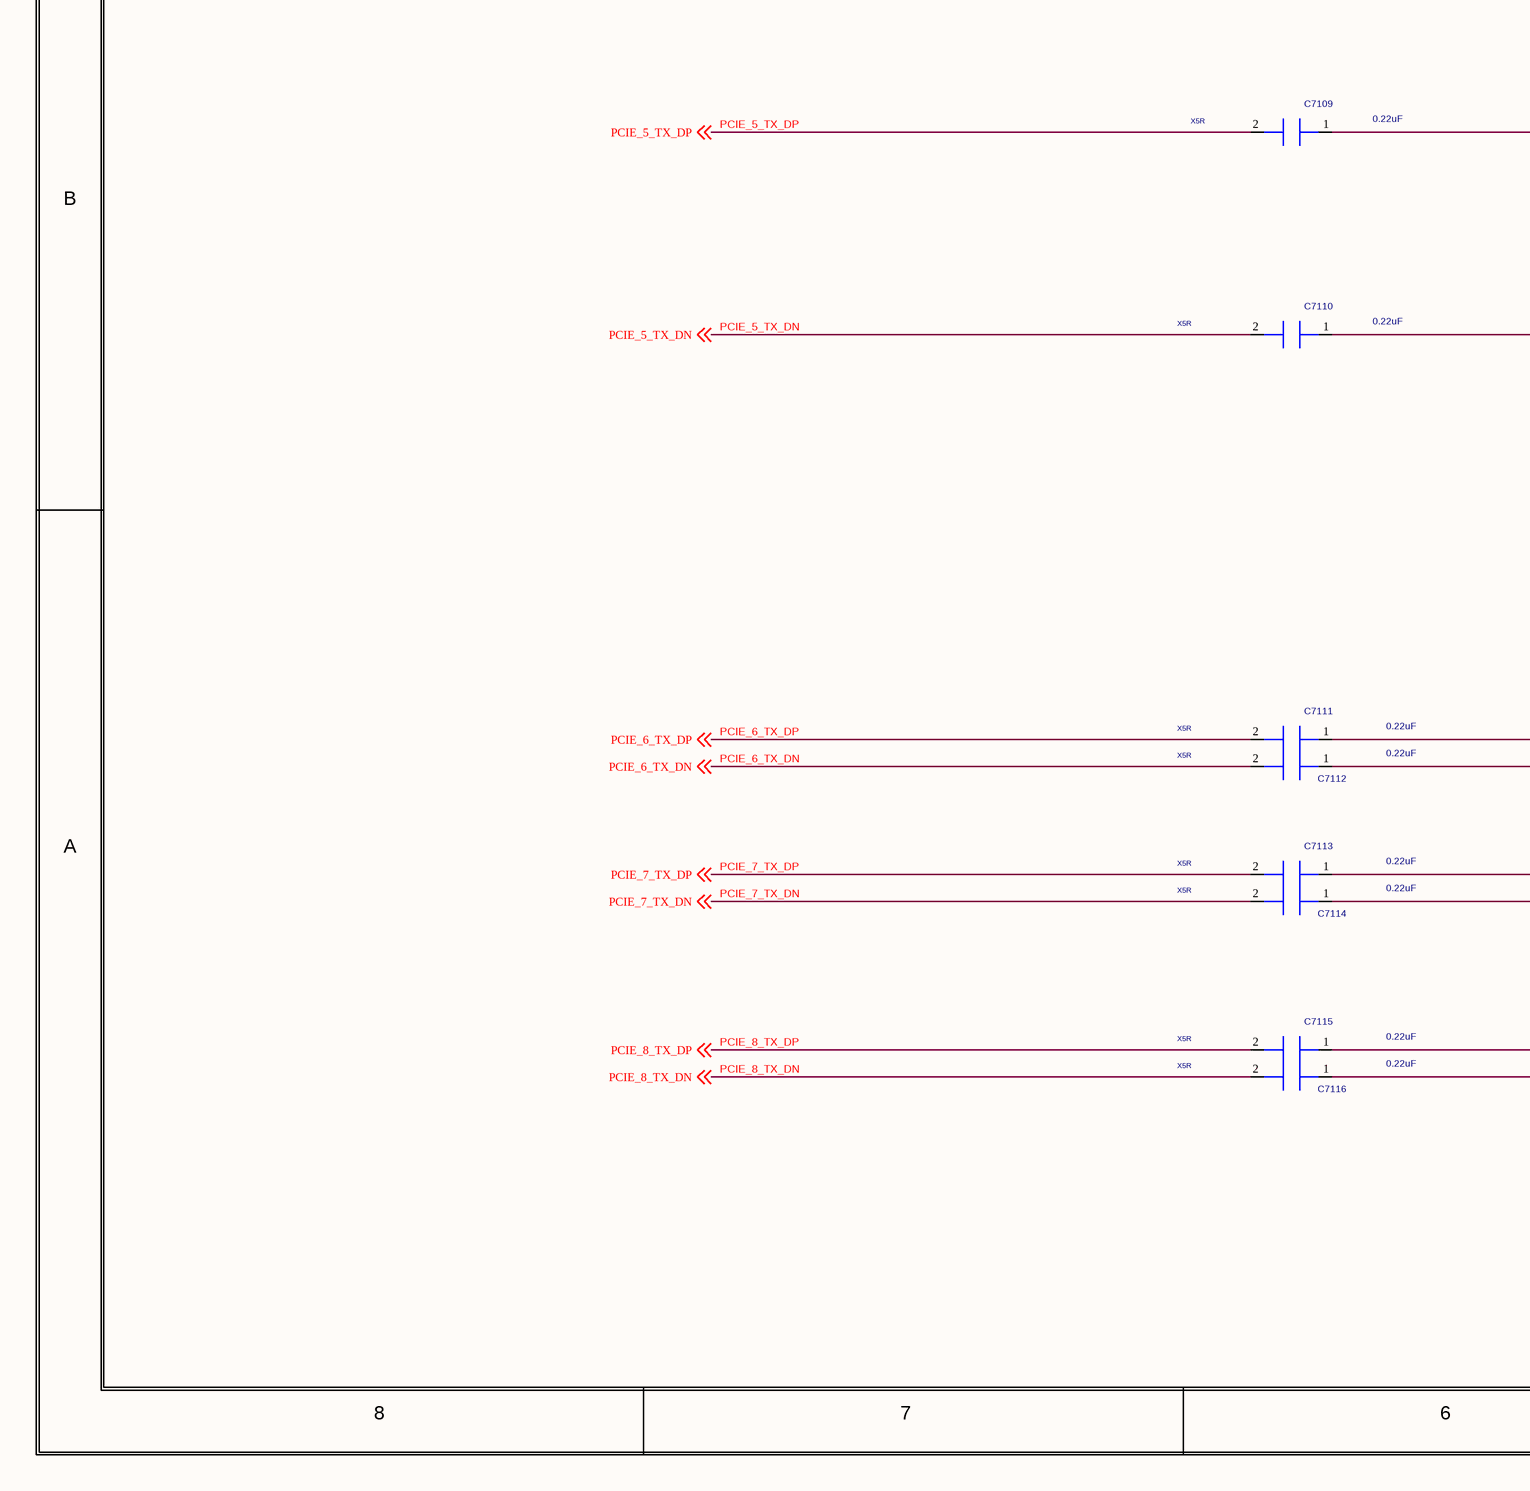
[diagram p107: 0071_HSIO MUXING -2.SchDoc, bottom left]
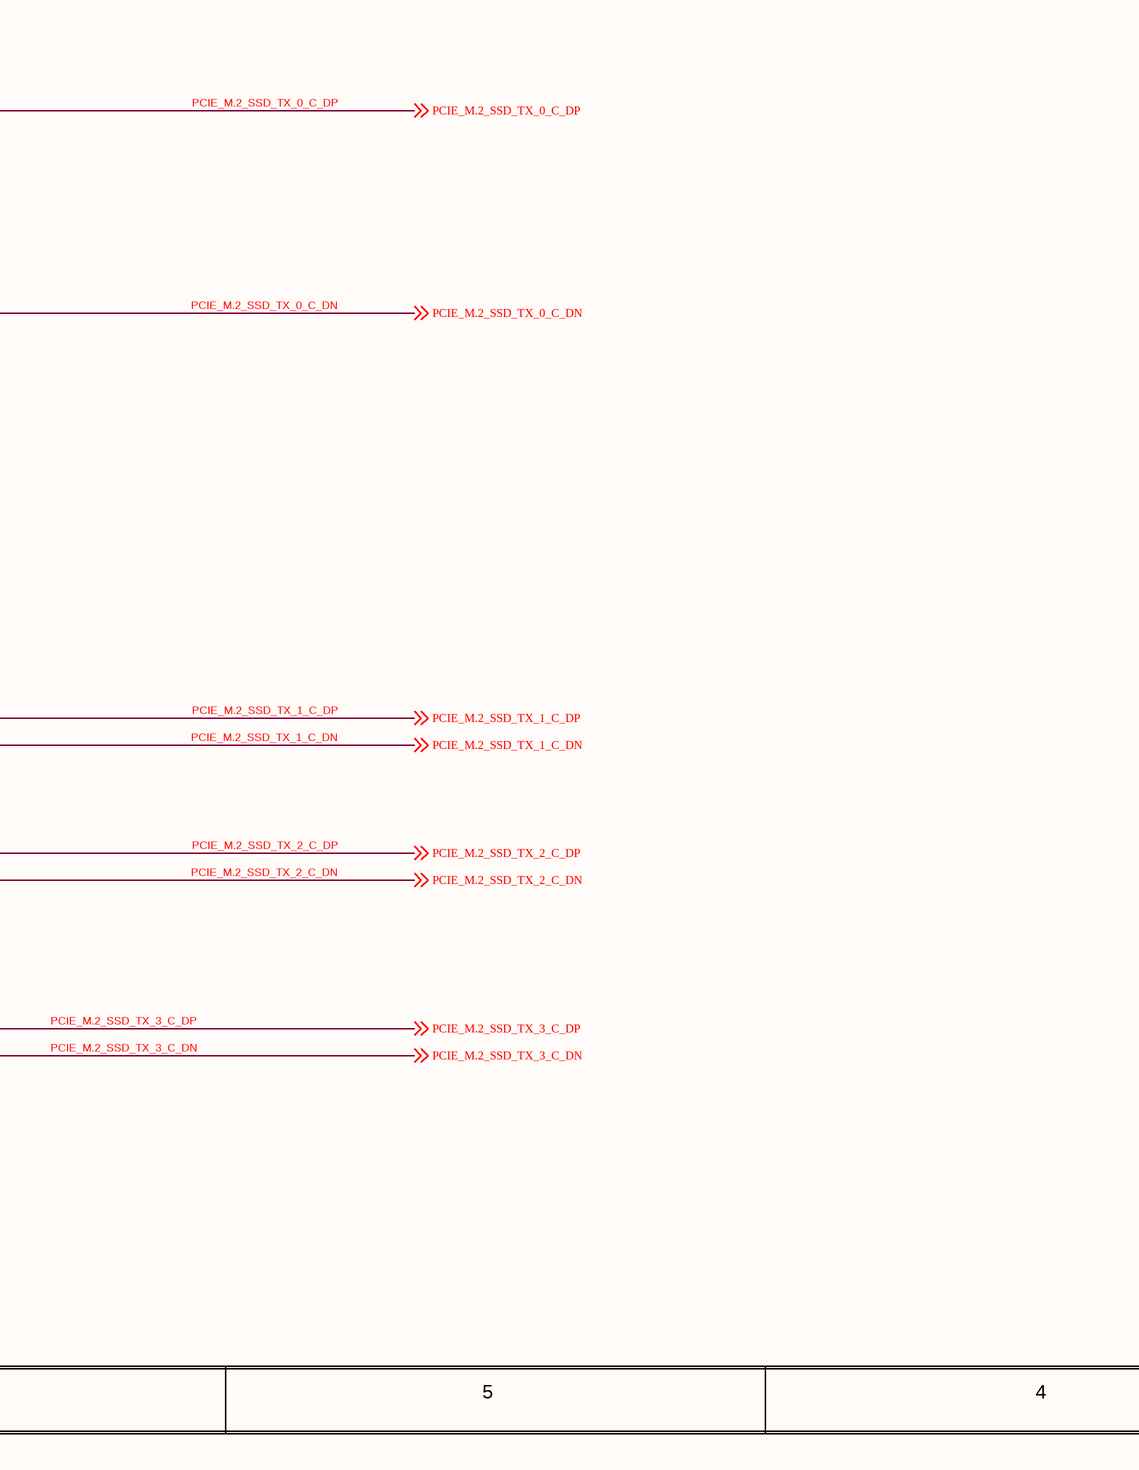
[diagram p108: 0071_HSIO MUXING -2.SchDoc, bottom middle]
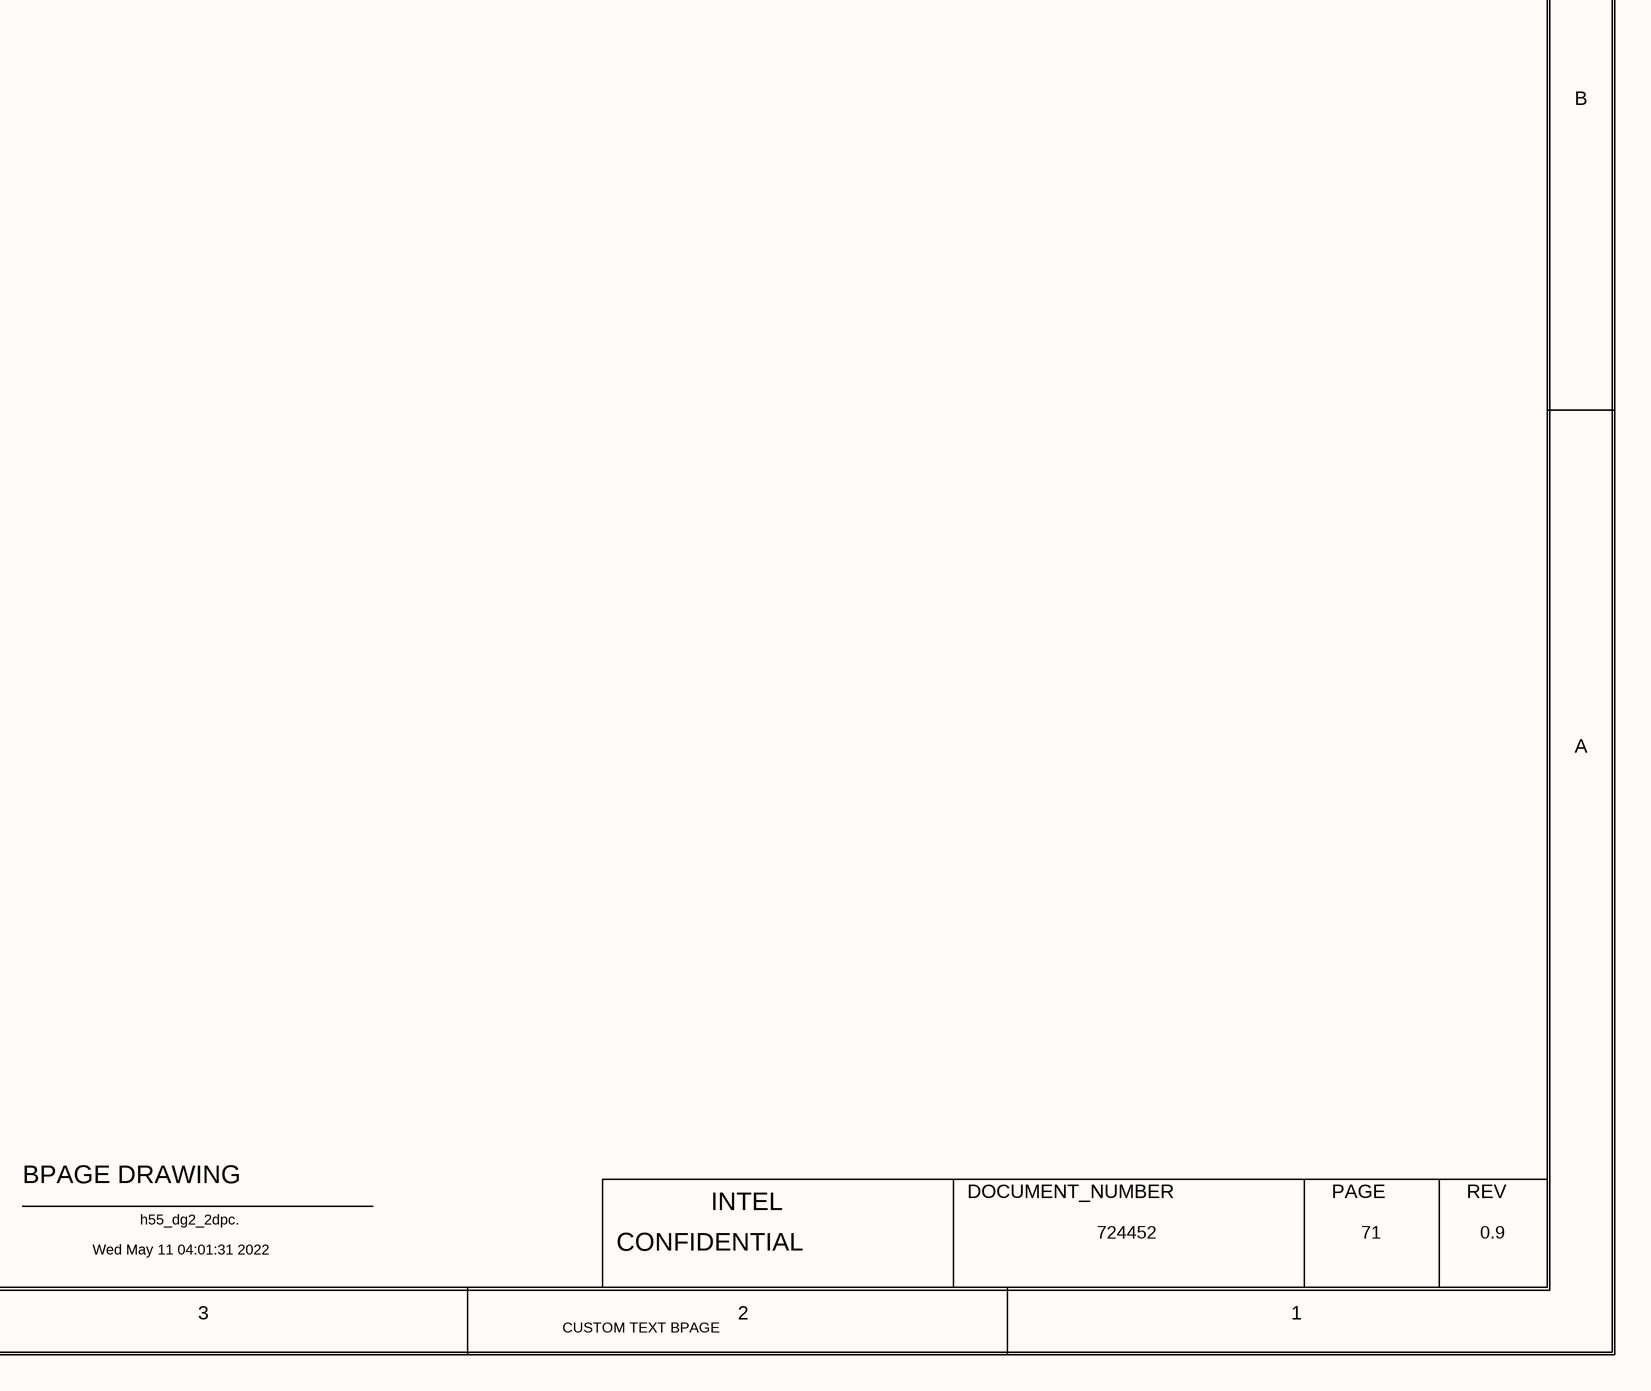
[diagram p109: 0071_HSIO MUXING -2.SchDoc, bottom right]

### Parts
C7101  0.22uF  MATERIAL: X5R  [SMC0201MB]
C7102  0.22uF  MATERIAL: X5R  [SMC0201MB]
C7103  0.22uF  MATERIAL: X5R  [SMC0201MB]
C7104  0.22uF  MATERIAL: X5R  [SMC0201MB]
C7105  0.22uF  MATERIAL: X5R  [SMC0201MB]
C7106  0.22uF  MATERIAL: X5R  [SMC0201MB]
C7107  0.22uF  MATERIAL: X5R  [SMC0201MB]
C7108  0.22uF  MATERIAL: X5R  [SMC0201MB]
C7109  0.22uF  MATERIAL: X5R  [SMC0201MB]
C7110  0.22uF  MATERIAL: X5R  [SMC0201MB]
C7111  0.22uF  MATERIAL: X5R  [SMC0201MB]
C7112  0.22uF  MATERIAL: X5R  [SMC0201MB]
C7113  0.22uF  MATERIAL: X5R  [SMC0201MB]
C7114  0.22uF  MATERIAL: X5R  [SMC0201MB]
C7115  0.22uF  MATERIAL: X5R  [SMC0201MB]
C7116  0.22uF  MATERIAL: X5R  [SMC0201MB]

### Nets
PCIE_5_TX_DN: C7110.2(B) ; off-sheet PCIE_5_TX_DN
PCIE_5_TX_DP: C7109.2(B) ; off-sheet PCIE_5_TX_DP
PCIE_6_TX_DN: C7112.2(B) ; off-sheet PCIE_6_TX_DN
PCIE_6_TX_DP: C7111.2(B) ; off-sheet PCIE_6_TX_DP
PCIE_7_TX_DN: C7114.2(B) ; off-sheet PCIE_7_TX_DN
PCIE_7_TX_DP: C7113.2(B) ; off-sheet PCIE_7_TX_DP
PCIE_8_TX_DN: C7116.2(B) ; off-sheet PCIE_8_TX_DN
PCIE_8_TX_DP: C7115.2(B) ; off-sheet PCIE_8_TX_DP
PCIE_25_TX_DN: C7102.2(B) ; off-sheet PCIE_25_TX_DN
PCIE_25_TX_DP: C7101.2(B) ; off-sheet PCIE_25_TX_DP
PCIE_26_TX_DN: C7104.2(B) ; off-sheet PCIE_26_TX_DN
PCIE_26_TX_DP: C7103.2(B) ; off-sheet PCIE_26_TX_DP
PCIE_27_TX_DN: C7106.2(B) ; off-sheet PCIE_27_TX_DN
PCIE_27_TX_DP: C7105.2(B) ; off-sheet PCIE_27_TX_DP
PCIE_28_TX_DN: C7108.2(B) ; off-sheet PCIE_28_TX_DN
PCIE_28_TX_DP: C7107.2(B) ; off-sheet PCIE_28_TX_DP
PCIE_M.2_SSD_2_TX_0_DN: C7102.1(A) ; off-sheet PCIE_M.2_SSD_2_TX_0_DN
PCIE_M.2_SSD_2_TX_0_DP: C7101.1(A) ; off-sheet PCIE_M.2_SSD_2_TX_0_DP
PCIE_M.2_SSD_2_TX_1_DN: C7104.1(A) ; off-sheet PCIE_M.2_SSD_2_TX_1_DN
PCIE_M.2_SSD_2_TX_1_DP: C7103.1(A) ; off-sheet PCIE_M.2_SSD_2_TX_1_DP
PCIE_M.2_SSD_2_TX_2_DN: C7106.1(A) ; off-sheet PCIE_M.2_SSD_2_TX_2_DN
PCIE_M.2_SSD_2_TX_2_DP: C7105.1(A) ; off-sheet PCIE_M.2_SSD_2_TX_2_DP
PCIE_M.2_SSD_2_TX_3_DN: C7108.1(A) ; off-sheet PCIE_M.2_SSD_2_TX_3_DN
PCIE_M.2_SSD_2_TX_3_DP: C7107.1(A) ; off-sheet PCIE_M.2_SSD_2_TX_3_DP
PCIE_M.2_SSD_TX_0_C_DN: C7110.1(A) ; off-sheet PCIE_M.2_SSD_TX_0_C_DN
PCIE_M.2_SSD_TX_0_C_DP: C7109.1(A) ; off-sheet PCIE_M.2_SSD_TX_0_C_DP
PCIE_M.2_SSD_TX_1_C_DN: C7112.1(A) ; off-sheet PCIE_M.2_SSD_TX_1_C_DN
PCIE_M.2_SSD_TX_1_C_DP: C7111.1(A) ; off-sheet PCIE_M.2_SSD_TX_1_C_DP
PCIE_M.2_SSD_TX_2_C_DN: C7114.1(A) ; off-sheet PCIE_M.2_SSD_TX_2_C_DN
PCIE_M.2_SSD_TX_2_C_DP: C7113.1(A) ; off-sheet PCIE_M.2_SSD_TX_2_C_DP
PCIE_M.2_SSD_TX_3_C_DN: C7116.1(A) ; off-sheet PCIE_M.2_SSD_TX_3_C_DN
PCIE_M.2_SSD_TX_3_C_DP: C7115.1(A) ; off-sheet PCIE_M.2_SSD_TX_3_C_DP

### Notes on the sheet
- <XR_PAGE_TITLE>
- 8
- 7
- 6
- 5
- 4
- 3
- 2
- 1
- MODULE REV DETAILS
- MODULE NAME
- REV
- DATE
- D
- C
- B
- A
- BPAGE DRAWING
- INTEL
- DOCUMENT_NUMBER
- PAGE
- Wed May 11 04:01:31 2022
- h55_dg2_2dpc.
- CONFIDENTIAL
- 724452
- 71
- 0.9
- CUSTOM TEXT BPAGE

### Library data of the parts
C7101 = CAP#2: PART_NUMBER: K27071-001; CHIPS_PART_NAME: CAP; CDS_PHYS_PART_NAME: CAP_0201-K27071-001,X5R,0.22UF,25V,20%,LPDB,GENERIC; PACK_TYPE: 0201; TOLERANCE: 20%; VOLTAGE: 25V; OriginalSymbolOrigin: (-75,25); XY: (-12525,7225); VER: 4; ROT: 2; PHYS_PAGE: 71; LOCATION: C7101; IP: GENERIC; FP_TECH: LPDB; DRAWING: @RVP1_ADL_SB_ADP_S_DDR5_SODIMM_2DPC_LIB.H55_DG2_2DPC(SCH_1):PAGE71; CDS_LIB: discrete; PCB Footprint: SMC0201MB; CDS_PART_NAME: CAP_0201-K27071-001,X5R,0.22UF,25V,20%,LPDB,GENERIC; CDS_LOCATION: C7101; ASI_MODEL: K27071-001
C7102 = CAP#2: PART_NUMBER: K27071-001; CHIPS_PART_NAME: CAP; CDS_PHYS_PART_NAME: CAP_0201-K27071-001,X5R,0.22UF,25V,20%,LPDB,GENERIC; PACK_TYPE: 0201; TOLERANCE: 20%; VOLTAGE: 25V; OriginalSymbolOrigin: (-75,25); XY: (-12525,7175); VER: 4; ROT: 2; PHYS_PAGE: 71; LOCATION: C7102; IP: GENERIC; FP_TECH: LPDB; DRAWING: @RVP1_ADL_SB_ADP_S_DDR5_SODIMM_2DPC_LIB.H55_DG2_2DPC(SCH_1):PAGE71; CDS_LIB: discrete; PCB Footprint: SMC0201MB; CDS_PART_NAME: CAP_0201-K27071-001,X5R,0.22UF,25V,20%,LPDB,GENERIC; CDS_LOCATION: C7102; ASI_MODEL: K27071-001
C7103 = CAP#2: PART_NUMBER: K27071-001; CHIPS_PART_NAME: CAP; CDS_PHYS_PART_NAME: CAP_0201-K27071-001,X5R,0.22UF,25V,20%,LPDB,GENERIC; PACK_TYPE: 0201; TOLERANCE: 20%; VOLTAGE: 25V; OriginalSymbolOrigin: (-75,25); XY: (-12525,6875); VER: 4; ROT: 2; PHYS_PAGE: 71; LOCATION: C7103; IP: GENERIC; FP_TECH: LPDB; DRAWING: @RVP1_ADL_SB_ADP_S_DDR5_SODIMM_2DPC_LIB.H55_DG2_2DPC(SCH_1):PAGE71; CDS_LIB: discrete; PCB Footprint: SMC0201MB; CDS_PART_NAME: CAP_0201-K27071-001,X5R,0.22UF,25V,20%,LPDB,GENERIC; CDS_LOCATION: C7103; ASI_MODEL: K27071-001
C7104 = CAP#2: PART_NUMBER: K27071-001; CHIPS_PART_NAME: CAP; CDS_PHYS_PART_NAME: CAP_0201-K27071-001,X5R,0.22UF,25V,20%,LPDB,GENERIC; PACK_TYPE: 0201; TOLERANCE: 20%; VOLTAGE: 25V; OriginalSymbolOrigin: (-75,25); XY: (-12525,6825); VER: 4; ROT: 2; PHYS_PAGE: 71; LOCATION: C7104; IP: GENERIC; FP_TECH: LPDB; DRAWING: @RVP1_ADL_SB_ADP_S_DDR5_SODIMM_2DPC_LIB.H55_DG2_2DPC(SCH_1):PAGE71; CDS_LIB: discrete; PCB Footprint: SMC0201MB; CDS_PART_NAME: CAP_0201-K27071-001,X5R,0.22UF,25V,20%,LPDB,GENERIC; CDS_LOCATION: C7104; ASI_MODEL: K27071-001
C7105 = CAP#2: PART_NUMBER: K27071-001; CHIPS_PART_NAME: CAP; CDS_PHYS_PART_NAME: CAP_0201-K27071-001,X5R,0.22UF,25V,20%,LPDB,GENERIC; PACK_TYPE: 0201; TOLERANCE: 20%; VOLTAGE: 25V; OriginalSymbolOrigin: (-75,25); XY: (-12525,6550); VER: 4; ROT: 2; PHYS_PAGE: 71; LOCATION: C7105; IP: GENERIC; FP_TECH: LPDB; DRAWING: @RVP1_ADL_SB_ADP_S_DDR5_SODIMM_2DPC_LIB.H55_DG2_2DPC(SCH_1):PAGE71; CDS_LIB: discrete; PCB Footprint: SMC0201MB; CDS_PART_NAME: CAP_0201-K27071-001,X5R,0.22UF,25V,20%,LPDB,GENERIC; CDS_LOCATION: C7105; ASI_MODEL: K27071-001
C7106 = CAP#2: PART_NUMBER: K27071-001; CHIPS_PART_NAME: CAP; CDS_PHYS_PART_NAME: CAP_0201-K27071-001,X5R,0.22UF,25V,20%,LPDB,GENERIC; PACK_TYPE: 0201; TOLERANCE: 20%; VOLTAGE: 25V; OriginalSymbolOrigin: (-75,25); XY: (-12525,6500); VER: 4; ROT: 2; PHYS_PAGE: 71; LOCATION: C7106; IP: GENERIC; FP_TECH: LPDB; DRAWING: @RVP1_ADL_SB_ADP_S_DDR5_SODIMM_2DPC_LIB.H55_DG2_2DPC(SCH_1):PAGE71; CDS_LIB: discrete; PCB Footprint: SMC0201MB; CDS_PART_NAME: CAP_0201-K27071-001,X5R,0.22UF,25V,20%,LPDB,GENERIC; CDS_LOCATION: C7106; ASI_MODEL: K27071-001
C7107 = CAP#2: PART_NUMBER: K27071-001; CHIPS_PART_NAME: CAP; CDS_PHYS_PART_NAME: CAP_0201-K27071-001,X5R,0.22UF,25V,20%,LPDB,GENERIC; PACK_TYPE: 0201; TOLERANCE: 20%; VOLTAGE: 25V; OriginalSymbolOrigin: (-75,25); XY: (-12525,6225); VER: 4; ROT: 2; PHYS_PAGE: 71; LOCATION: C7107; IP: GENERIC; FP_TECH: LPDB; DRAWING: @RVP1_ADL_SB_ADP_S_DDR5_SODIMM_2DPC_LIB.H55_DG2_2DPC(SCH_1):PAGE71; CDS_LIB: discrete; PCB Footprint: SMC0201MB; CDS_PART_NAME: CAP_0201-K27071-001,X5R,0.22UF,25V,20%,LPDB,GENERIC; CDS_LOCATION: C7107; ASI_MODEL: K27071-001
C7108 = CAP#2: PART_NUMBER: K27071-001; CHIPS_PART_NAME: CAP; CDS_PHYS_PART_NAME: CAP_0201-K27071-001,X5R,0.22UF,25V,20%,LPDB,GENERIC; PACK_TYPE: 0201; TOLERANCE: 20%; VOLTAGE: 25V; OriginalSymbolOrigin: (-75,25); XY: (-12525,6175); VER: 4; ROT: 2; PHYS_PAGE: 71; LOCATION: C7108; IP: GENERIC; FP_TECH: LPDB; DRAWING: @RVP1_ADL_SB_ADP_S_DDR5_SODIMM_2DPC_LIB.H55_DG2_2DPC(SCH_1):PAGE71; CDS_LIB: discrete; PCB Footprint: SMC0201MB; CDS_PART_NAME: CAP_0201-K27071-001,X5R,0.22UF,25V,20%,LPDB,GENERIC; CDS_LOCATION: C7108; ASI_MODEL: K27071-001
C7109 = CAP#2: PART_NUMBER: K27071-001; CHIPS_PART_NAME: CAP; CDS_PHYS_PART_NAME: CAP_0201-K27071-001,X5R,0.22UF,25V,20%,LPDB,GENERIC; PACK_TYPE: 0201; TOLERANCE: 20%; VOLTAGE: 25V; OriginalSymbolOrigin: (-75,25); XY: (-12525,5150); VER: 4; ROT: 2; PHYS_PAGE: 71; LOCATION: C7109; IP: GENERIC; FP_TECH: LPDB; DRAWING: @RVP1_ADL_SB_ADP_S_DDR5_SODIMM_2DPC_LIB.H55_DG2_2DPC(SCH_1):PAGE71; CDS_LIB: discrete; PCB Footprint: SMC0201MB; CDS_PART_NAME: CAP_0201-K27071-001,X5R,0.22UF,25V,20%,LPDB,GENERIC; CDS_LOCATION: C7109; ASI_MODEL: K27071-001
C7110 = CAP#2: PART_NUMBER: K27071-001; CHIPS_PART_NAME: CAP; CDS_PHYS_PART_NAME: CAP_0201-K27071-001,X5R,0.22UF,25V,20%,LPDB,GENERIC; PACK_TYPE: 0201; TOLERANCE: 20%; VOLTAGE: 25V; OriginalSymbolOrigin: (-75,25); XY: (-12525,4775); VER: 4; ROT: 2; PHYS_PAGE: 71; LOCATION: C7110; IP: GENERIC; FP_TECH: LPDB; DRAWING: @RVP1_ADL_SB_ADP_S_DDR5_SODIMM_2DPC_LIB.H55_DG2_2DPC(SCH_1):PAGE71; CDS_LIB: discrete; PCB Footprint: SMC0201MB; CDS_PART_NAME: CAP_0201-K27071-001,X5R,0.22UF,25V,20%,LPDB,GENERIC; CDS_LOCATION: C7110; ASI_MODEL: K27071-001
C7111 = CAP#2: PART_NUMBER: K27071-001; CHIPS_PART_NAME: CAP; CDS_PHYS_PART_NAME: CAP_0201-K27071-001,X5R,0.22UF,25V,20%,LPDB,GENERIC; PACK_TYPE: 0201; TOLERANCE: 20%; VOLTAGE: 25V; OriginalSymbolOrigin: (-75,25); XY: (-12525,4025); VER: 4; ROT: 2; PHYS_PAGE: 71; LOCATION: C7111; IP: GENERIC; FP_TECH: LPDB; DRAWING: @RVP1_ADL_SB_ADP_S_DDR5_SODIMM_2DPC_LIB.H55_DG2_2DPC(SCH_1):PAGE71; CDS_LIB: discrete; PCB Footprint: SMC0201MB; CDS_PART_NAME: CAP_0201-K27071-001,X5R,0.22UF,25V,20%,LPDB,GENERIC; CDS_LOCATION: C7111; ASI_MODEL: K27071-001
C7112 = CAP#2: PART_NUMBER: K27071-001; CHIPS_PART_NAME: CAP; CDS_PHYS_PART_NAME: CAP_0201-K27071-001,X5R,0.22UF,25V,20%,LPDB,GENERIC; PACK_TYPE: 0201; TOLERANCE: 20%; VOLTAGE: 25V; OriginalSymbolOrigin: (-75,25); XY: (-12525,3975); VER: 4; ROT: 2; PHYS_PAGE: 71; LOCATION: C7112; IP: GENERIC; FP_TECH: LPDB; DRAWING: @RVP1_ADL_SB_ADP_S_DDR5_SODIMM_2DPC_LIB.H55_DG2_2DPC(SCH_1):PAGE71; CDS_LIB: discrete; PCB Footprint: SMC0201MB; CDS_PART_NAME: CAP_0201-K27071-001,X5R,0.22UF,25V,20%,LPDB,GENERIC; CDS_LOCATION: C7112; ASI_MODEL: K27071-001
C7113 = CAP#2: PART_NUMBER: K27071-001; CHIPS_PART_NAME: CAP; CDS_PHYS_PART_NAME: CAP_0201-K27071-001,X5R,0.22UF,25V,20%,LPDB,GENERIC; PACK_TYPE: 0201; TOLERANCE: 20%; VOLTAGE: 25V; OriginalSymbolOrigin: (-75,25); XY: (-12525,3775); VER: 4; ROT: 2; PHYS_PAGE: 71; LOCATION: C7113; IP: GENERIC; FP_TECH: LPDB; DRAWING: @RVP1_ADL_SB_ADP_S_DDR5_SODIMM_2DPC_LIB.H55_DG2_2DPC(SCH_1):PAGE71; CDS_LIB: discrete; PCB Footprint: SMC0201MB; CDS_PART_NAME: CAP_0201-K27071-001,X5R,0.22UF,25V,20%,LPDB,GENERIC; CDS_LOCATION: C7113; ASI_MODEL: K27071-001
C7114 = CAP#2: PART_NUMBER: K27071-001; CHIPS_PART_NAME: CAP; CDS_PHYS_PART_NAME: CAP_0201-K27071-001,X5R,0.22UF,25V,20%,LPDB,GENERIC; PACK_TYPE: 0201; TOLERANCE: 20%; VOLTAGE: 25V; OriginalSymbolOrigin: (-75,25); XY: (-12525,3725); VER: 4; ROT: 2; PHYS_PAGE: 71; LOCATION: C7114; IP: GENERIC; FP_TECH: LPDB; DRAWING: @RVP1_ADL_SB_ADP_S_DDR5_SODIMM_2DPC_LIB.H55_DG2_2DPC(SCH_1):PAGE71; CDS_LIB: discrete; PCB Footprint: SMC0201MB; CDS_PART_NAME: CAP_0201-K27071-001,X5R,0.22UF,25V,20%,LPDB,GENERIC; CDS_LOCATION: C7114; ASI_MODEL: K27071-001
C7115 = CAP#2: PART_NUMBER: K27071-001; CHIPS_PART_NAME: CAP; CDS_PHYS_PART_NAME: CAP_0201-K27071-001,X5R,0.22UF,25V,20%,LPDB,GENERIC; PACK_TYPE: 0201; TOLERANCE: 20%; VOLTAGE: 25V; OriginalSymbolOrigin: (-75,25); XY: (-12525,3450); VER: 4; ROT: 2; PHYS_PAGE: 71; LOCATION: C7115; IP: GENERIC; FP_TECH: LPDB; DRAWING: @RVP1_ADL_SB_ADP_S_DDR5_SODIMM_2DPC_LIB.H55_DG2_2DPC(SCH_1):PAGE71; CDS_LIB: discrete; PCB Footprint: SMC0201MB; CDS_PART_NAME: CAP_0201-K27071-001,X5R,0.22UF,25V,20%,LPDB,GENERIC; CDS_LOCATION: C7115; ASI_MODEL: K27071-001
C7116 = CAP#2: PART_NUMBER: K27071-001; CHIPS_PART_NAME: CAP; CDS_PHYS_PART_NAME: CAP_0201-K27071-001,X5R,0.22UF,25V,20%,LPDB,GENERIC; PACK_TYPE: 0201; TOLERANCE: 20%; VOLTAGE: 25V; OriginalSymbolOrigin: (-75,25); XY: (-12525,3400); VER: 4; ROT: 2; PHYS_PAGE: 71; LOCATION: C7116; IP: GENERIC; FP_TECH: LPDB; DRAWING: @RVP1_ADL_SB_ADP_S_DDR5_SODIMM_2DPC_LIB.H55_DG2_2DPC(SCH_1):PAGE71; CDS_LIB: discrete; PCB Footprint: SMC0201MB; CDS_PART_NAME: CAP_0201-K27071-001,X5R,0.22UF,25V,20%,LPDB,GENERIC; CDS_LOCATION: C7116; ASI_MODEL: K27071-001

## Sheet 0072_HSIO MUXING -3.SchDoc
size 848 x 558 mm
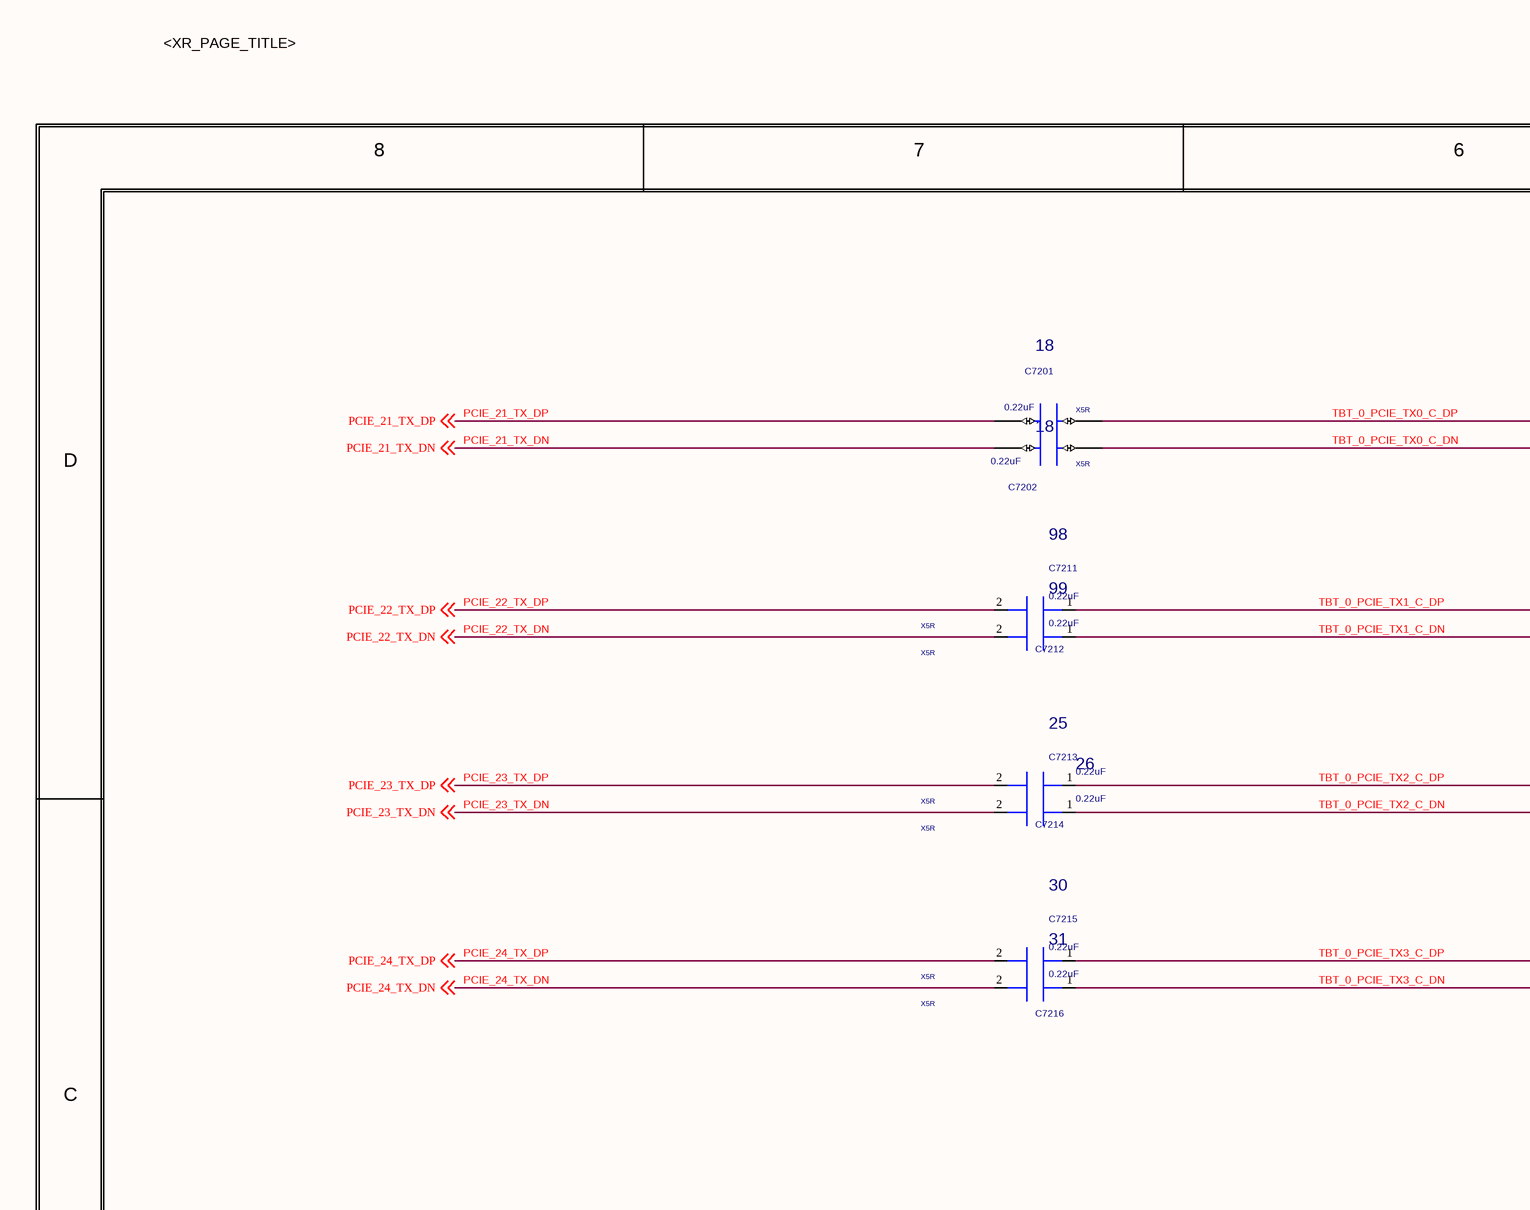
[diagram p110: 0072_HSIO MUXING -3.SchDoc, top left]
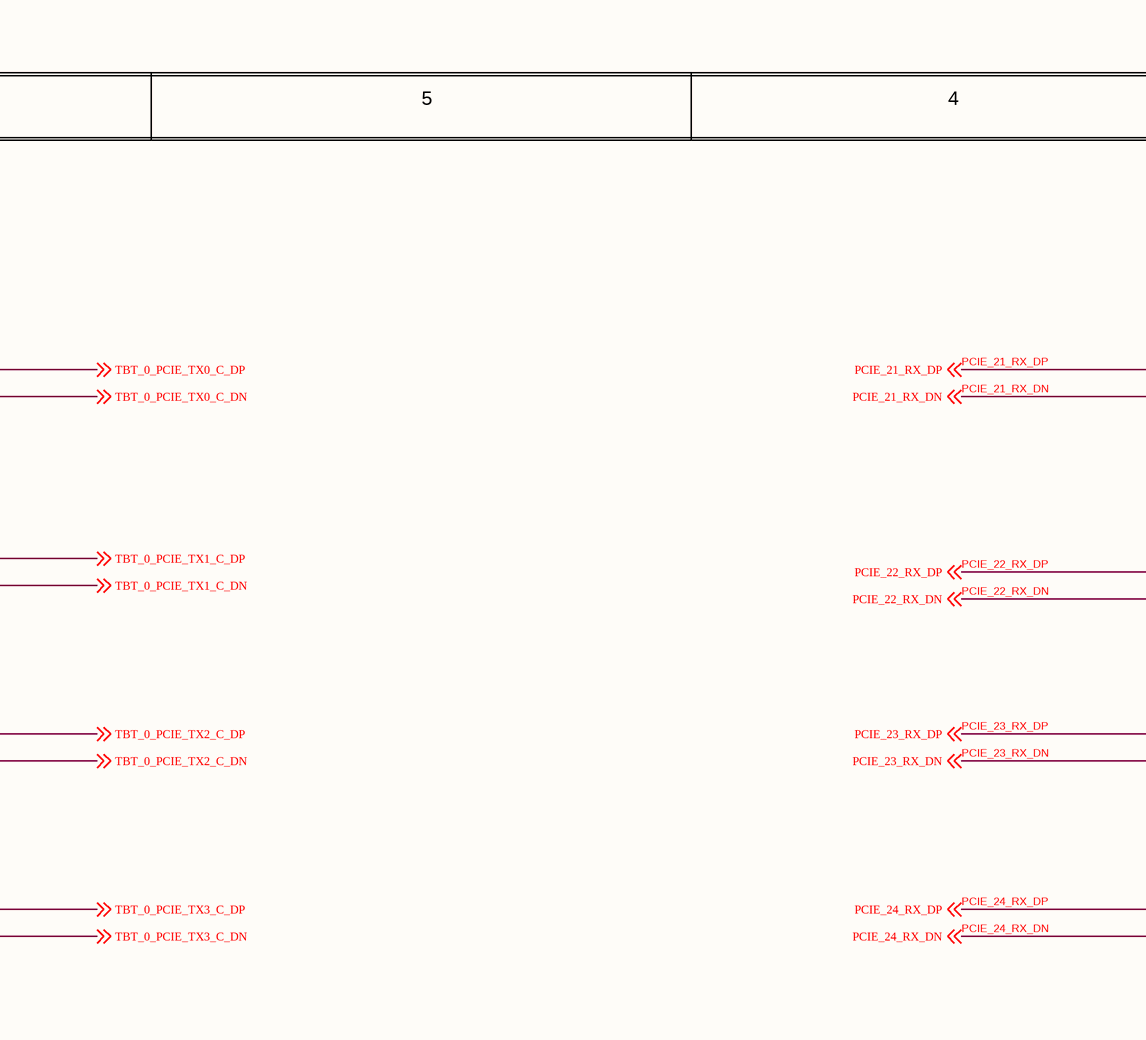
[diagram p111: 0072_HSIO MUXING -3.SchDoc, top middle]
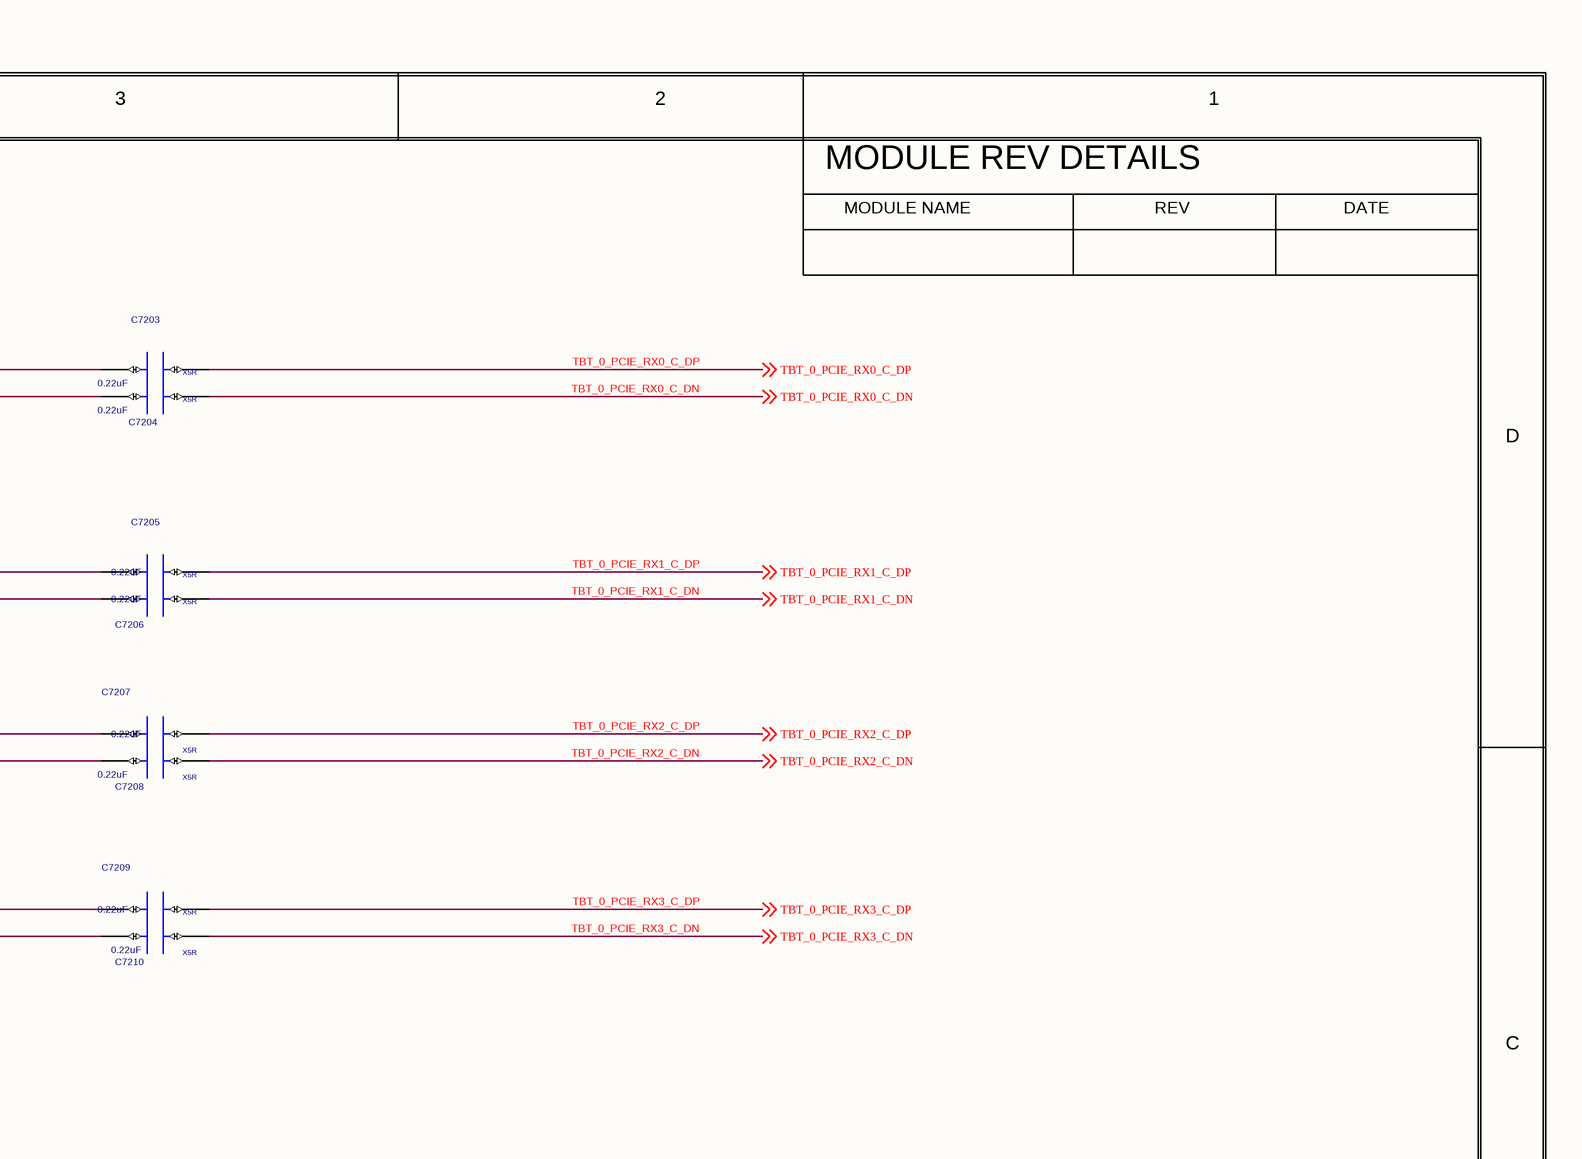
[diagram p112: 0072_HSIO MUXING -3.SchDoc, top right]
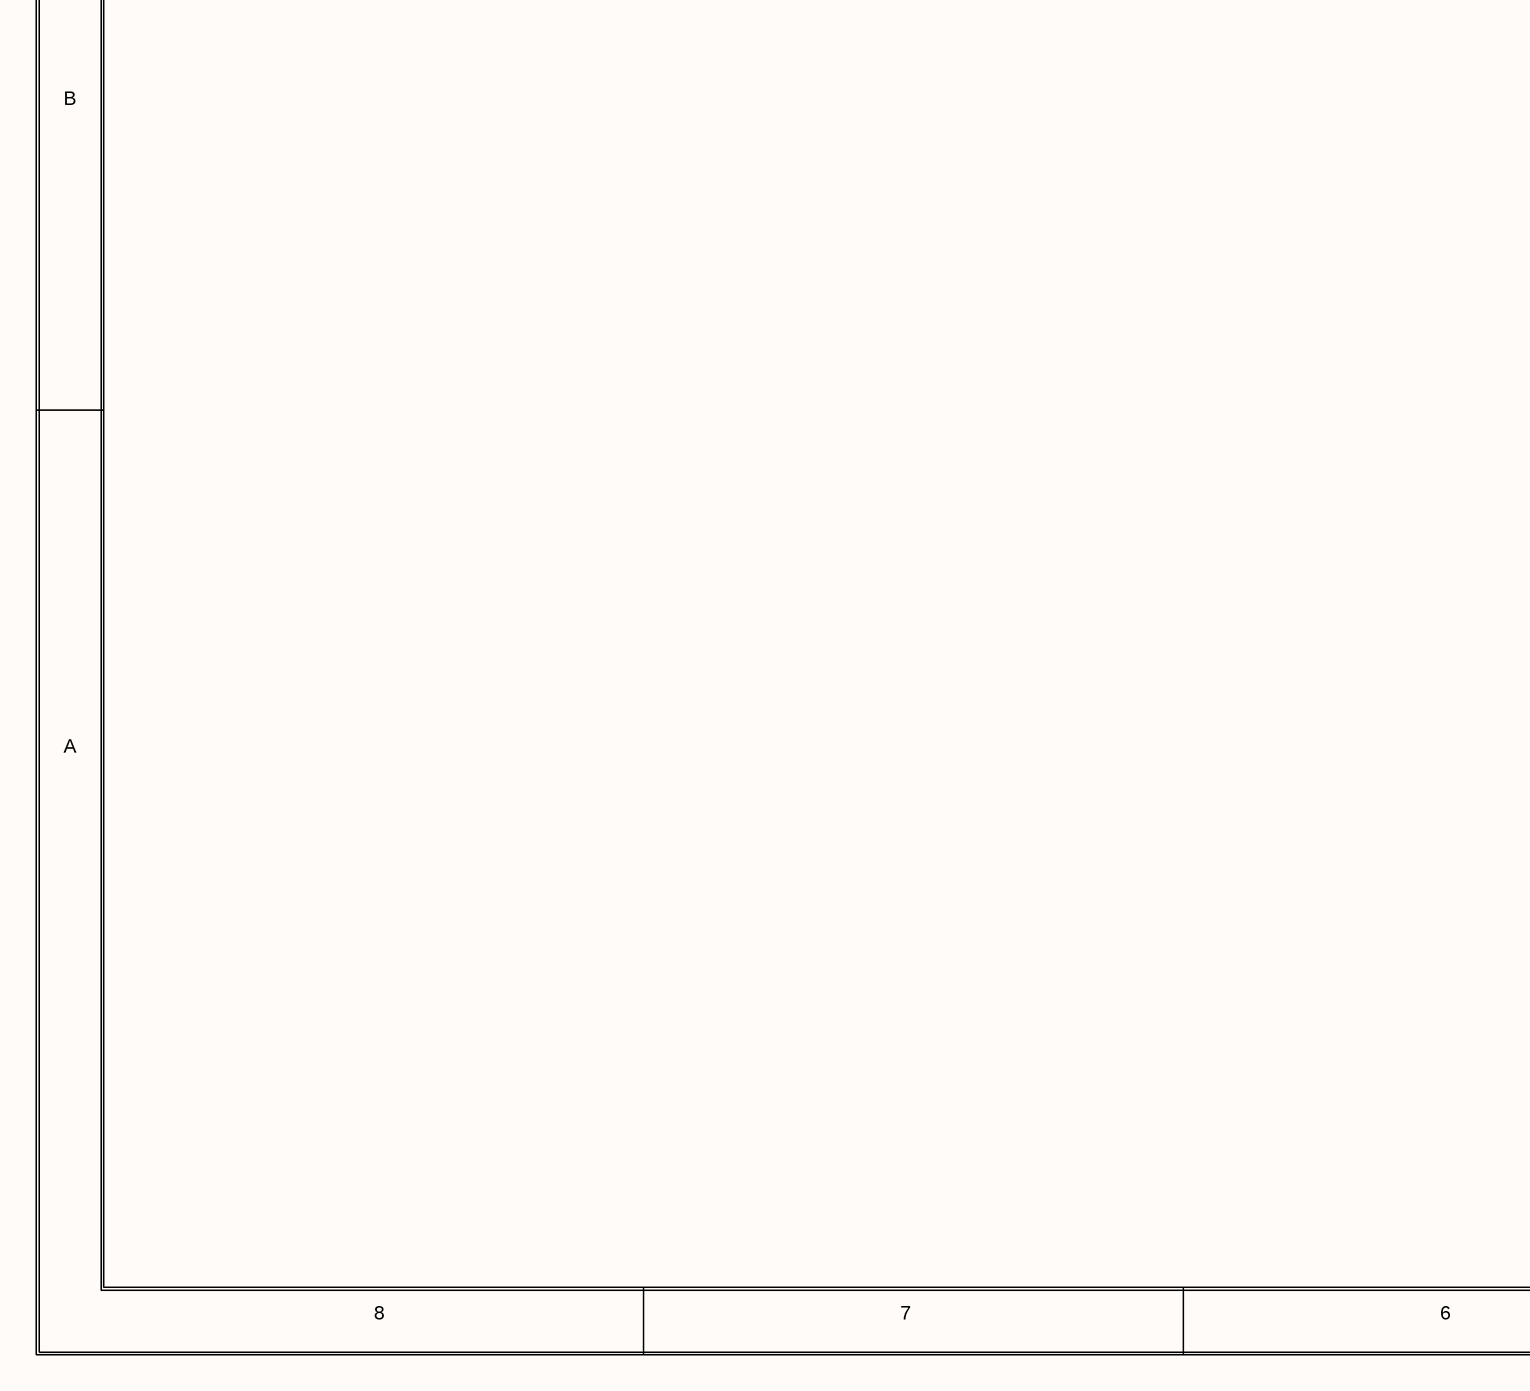
[diagram p113: 0072_HSIO MUXING -3.SchDoc, bottom left]
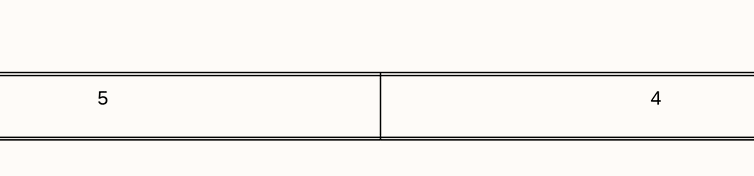
[diagram p114: 0072_HSIO MUXING -3.SchDoc, bottom middle]
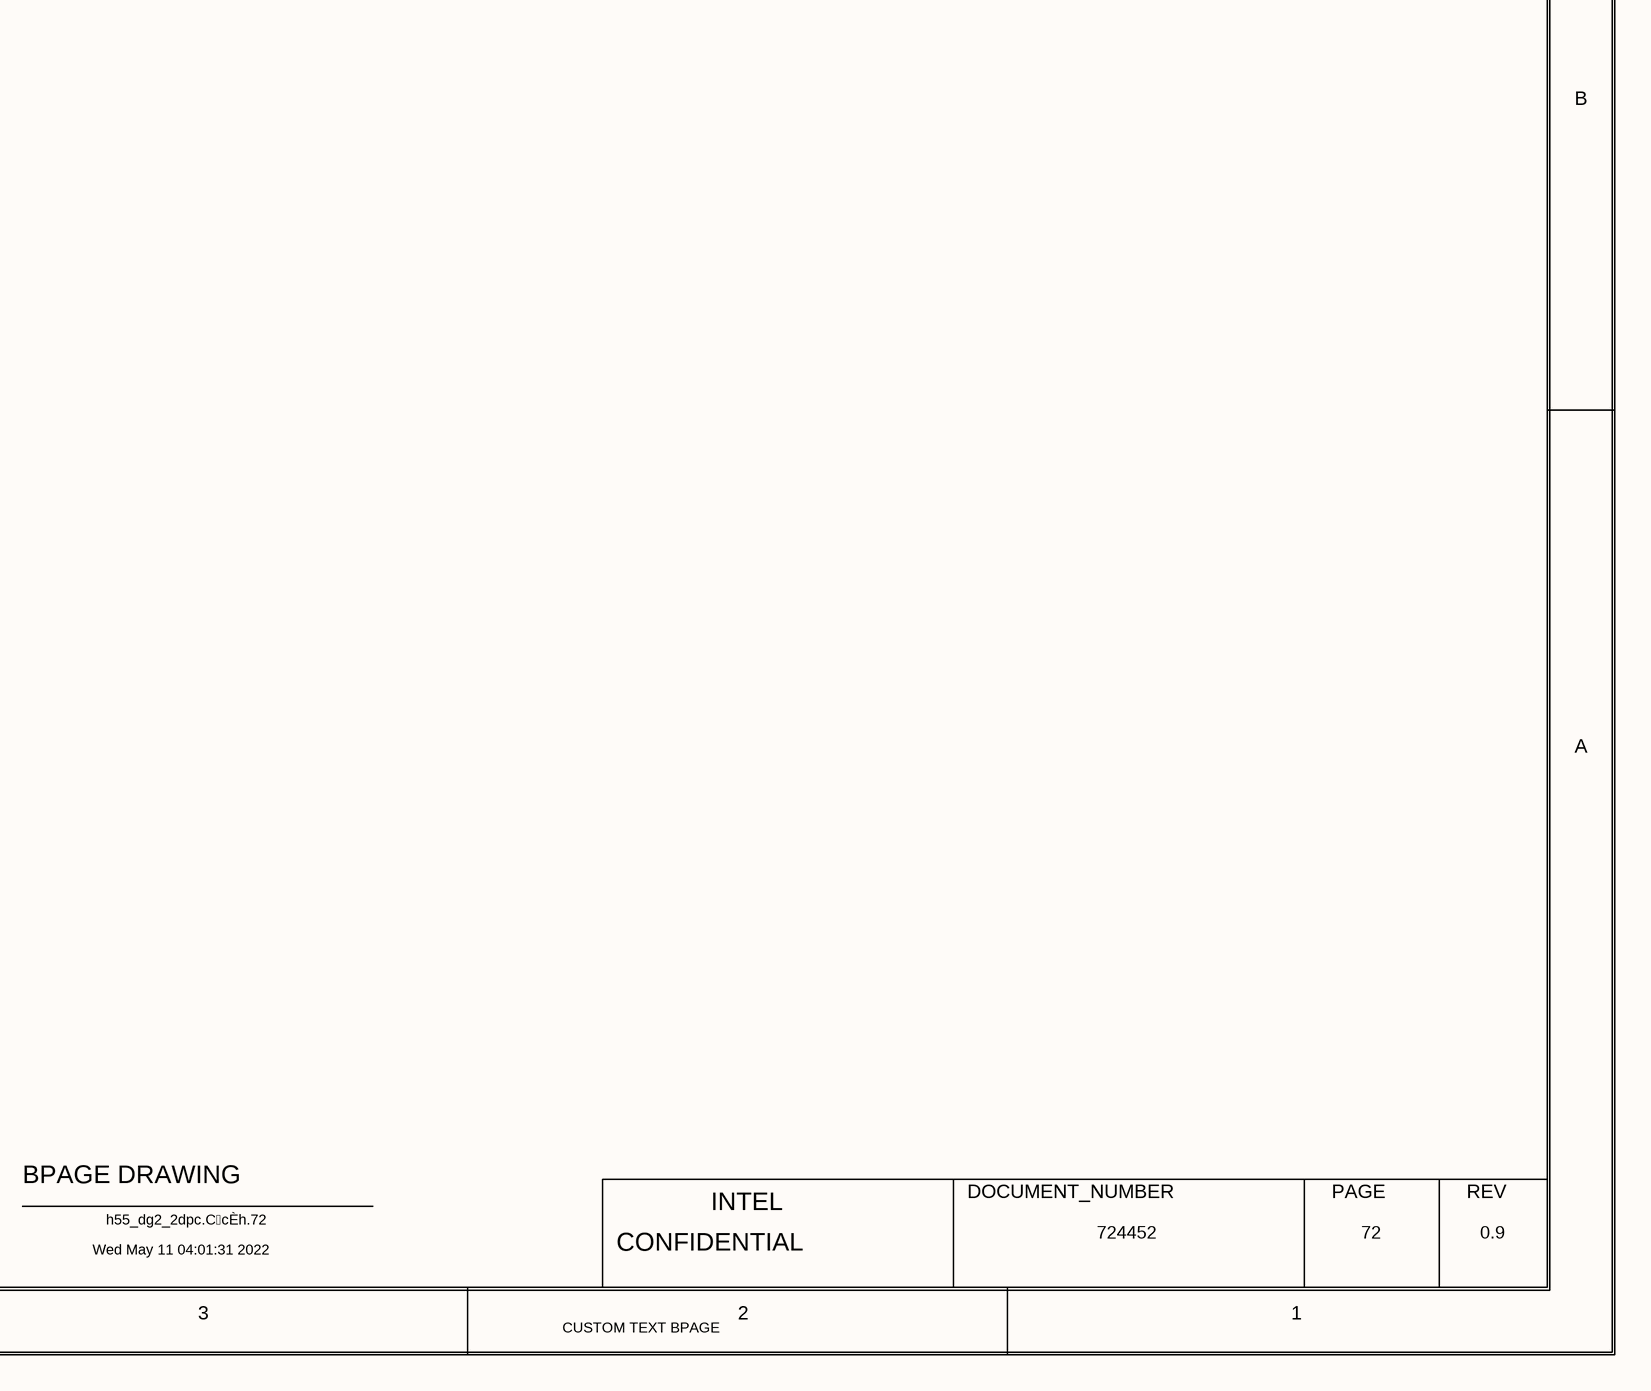
[diagram p115: 0072_HSIO MUXING -3.SchDoc, bottom right]

### Parts
C7201  0.22uF  MATERIAL: X5R  REUSE_ID: 18  [CTK0_SM0201_630X330_MA]
C7202  0.22uF  MATERIAL: X5R  REUSE_ID: 18  [CTK0_SM0201_630X330_MA]
C7203  0.22uF  MATERIAL: X5R  [CTK0_SM0201_630X330_MA]
C7204  0.22uF  MATERIAL: X5R  [CTK0_SM0201_630X330_MA]
C7205  0.22uF  MATERIAL: X5R  [CTK0_SM0201_630X330_MA]
C7206  0.22uF  MATERIAL: X5R  [CTK0_SM0201_630X330_MA]
C7207  0.22uF  MATERIAL: X5R  [CTK0_SM0201_630X330_MA]
C7208  0.22uF  MATERIAL: X5R  [CTK0_SM0201_630X330_MA]
C7209  0.22uF  MATERIAL: X5R  [CTK0_SM0201_630X330_MA]
C7210  0.22uF  MATERIAL: X5R  [CTK0_SM0201_630X330_MA]
C7211  0.22uF  MATERIAL: X5R  REUSE_ID: 98  [SMC0201MB]
C7212  0.22uF  MATERIAL: X5R  REUSE_ID: 99  [SMC0201MB]
C7213  0.22uF  MATERIAL: X5R  REUSE_ID: 25  [SMC0201MB]
C7214  0.22uF  MATERIAL: X5R  REUSE_ID: 26  [SMC0201MB]
C7215  0.22uF  MATERIAL: X5R  REUSE_ID: 30  [SMC0201MB]
C7216  0.22uF  MATERIAL: X5R  REUSE_ID: 31  [SMC0201MB]

### Nets
PCIE_21_RX_DN: C7204.1(A) ; off-sheet PCIE_21_RX_DN
PCIE_21_RX_DP: C7203.1(A) ; off-sheet PCIE_21_RX_DP
PCIE_21_TX_DN: C7202.1(A) ; off-sheet PCIE_21_TX_DN
PCIE_21_TX_DP: C7201.1(A) ; off-sheet PCIE_21_TX_DP
PCIE_22_RX_DN: C7206.1(A) ; off-sheet PCIE_22_RX_DN
PCIE_22_RX_DP: C7205.1(A) ; off-sheet PCIE_22_RX_DP
PCIE_22_TX_DN: C7212.2(B) ; off-sheet PCIE_22_TX_DN
PCIE_22_TX_DP: C7211.2(B) ; off-sheet PCIE_22_TX_DP
PCIE_23_RX_DN: C7208.1(A) ; off-sheet PCIE_23_RX_DN
PCIE_23_RX_DP: C7207.1(A) ; off-sheet PCIE_23_RX_DP
PCIE_23_TX_DN: C7214.2(B) ; off-sheet PCIE_23_TX_DN
PCIE_23_TX_DP: C7213.2(B) ; off-sheet PCIE_23_TX_DP
PCIE_24_RX_DN: C7210.1(A) ; off-sheet PCIE_24_RX_DN
PCIE_24_RX_DP: C7209.1(A) ; off-sheet PCIE_24_RX_DP
PCIE_24_TX_DN: C7216.2(B) ; off-sheet PCIE_24_TX_DN
PCIE_24_TX_DP: C7215.2(B) ; off-sheet PCIE_24_TX_DP
TBT_0_PCIE_RX0_C_DN: C7204.2(B) ; off-sheet TBT_0_PCIE_RX0_C_DN
TBT_0_PCIE_RX0_C_DP: C7203.2(B) ; off-sheet TBT_0_PCIE_RX0_C_DP
TBT_0_PCIE_RX1_C_DN: C7206.2(B) ; off-sheet TBT_0_PCIE_RX1_C_DN
TBT_0_PCIE_RX1_C_DP: C7205.2(B) ; off-sheet TBT_0_PCIE_RX1_C_DP
TBT_0_PCIE_RX2_C_DN: C7208.2(B) ; off-sheet TBT_0_PCIE_RX2_C_DN
TBT_0_PCIE_RX2_C_DP: C7207.2(B) ; off-sheet TBT_0_PCIE_RX2_C_DP
TBT_0_PCIE_RX3_C_DN: C7210.2(B) ; off-sheet TBT_0_PCIE_RX3_C_DN
TBT_0_PCIE_RX3_C_DP: C7209.2(B) ; off-sheet TBT_0_PCIE_RX3_C_DP
TBT_0_PCIE_TX0_C_DN: C7202.2(B) ; off-sheet TBT_0_PCIE_TX0_C_DN
TBT_0_PCIE_TX0_C_DP: C7201.2(B) ; off-sheet TBT_0_PCIE_TX0_C_DP
TBT_0_PCIE_TX1_C_DN: C7212.1(A) ; off-sheet TBT_0_PCIE_TX1_C_DN
TBT_0_PCIE_TX1_C_DP: C7211.1(A) ; off-sheet TBT_0_PCIE_TX1_C_DP
TBT_0_PCIE_TX2_C_DN: C7214.1(A) ; off-sheet TBT_0_PCIE_TX2_C_DN
TBT_0_PCIE_TX2_C_DP: C7213.1(A) ; off-sheet TBT_0_PCIE_TX2_C_DP
TBT_0_PCIE_TX3_C_DN: C7216.1(A) ; off-sheet TBT_0_PCIE_TX3_C_DN
TBT_0_PCIE_TX3_C_DP: C7215.1(A) ; off-sheet TBT_0_PCIE_TX3_C_DP

### Notes on the sheet
- <XR_PAGE_TITLE>
- 8
- 7
- 6
- 5
- 4
- 3
- 2
- 1
- MODULE REV DETAILS
- MODULE NAME
- REV
- DATE
- D
- C
- B
- A
- BPAGE DRAWING
- INTEL
- DOCUMENT_NUMBER
- PAGE
- Wed May 11 04:01:31 2022
- h55_dg2_2dpc.CcÈh.72
- CONFIDENTIAL
- 724452
- 72
- 0.9
- CUSTOM TEXT BPAGE

### Library data of the parts
C7201 = C_CAP#1: PART_NUMBER: K27071-001; CHIPS_PART_NAME: C_CAP; CDS_PHYS_PART_NAME: C_CAP_0201-K27071-001,X5R,0.22UF,25V,20%,TK0,GENERIC; CDS_LMAN_SYM_OUTLINE: -50,50,50,-50; FP_TECH: TK0; IP: GENERIC; PACK_TYPE: 0201; ROOM: NONE; TOLERANCE: 20%; VOLTAGE: 25V; OriginalSymbolOrigin: (-25,50); XY: (-8300,4950); VER: 2; ROT: 0; PHYS_PAGE: 72; LOCATION: C7201; DRAWING: @RVP1_ADL_SB_ADP_S_DDR5_SODIMM_2DPC_LIB.H55_DG2_2DPC(SCH_1):PAGE72; CDS_LIB: c_discrete; VARIANT: ?; PCB Footprint: CTK0_SM0201_630X330_MA; CDS_PART_NAME: C_CAP_0201-K27071-001,X5R,0.22UF,25V,20%,TK0,GENERIC; CDS_LOCATION: C7201
C7202 = C_CAP#1: PART_NUMBER: K27071-001; CHIPS_PART_NAME: C_CAP; CDS_PHYS_PART_NAME: C_CAP_0201-K27071-001,X5R,0.22UF,25V,20%,TK0,GENERIC; CDS_LMAN_SYM_OUTLINE: -50,50,50,-50; FP_TECH: TK0; IP: GENERIC; PACK_TYPE: 0201; ROOM: NONE; TOLERANCE: 20%; VOLTAGE: 25V; OriginalSymbolOrigin: (-25,50); XY: (-8300,4900); VER: 2; ROT: 0; PHYS_PAGE: 72; LOCATION: C7202; DRAWING: @RVP1_ADL_SB_ADP_S_DDR5_SODIMM_2DPC_LIB.H55_DG2_2DPC(SCH_1):PAGE72; CDS_LIB: c_discrete; VARIANT: ?; PCB Footprint: CTK0_SM0201_630X330_MA; CDS_PART_NAME: C_CAP_0201-K27071-001,X5R,0.22UF,25V,20%,TK0,GENERIC; CDS_LOCATION: C7202
C7203 = C_CAP#1: PART_NUMBER: K27071-001; CHIPS_PART_NAME: C_CAP; CDS_PHYS_PART_NAME: C_CAP_0201-K27071-001,X5R,0.22UF,25V,20%,TK0,GENERIC; CDS_LMAN_SYM_OUTLINE: -50,50,50,-50; FP_TECH: TK0; IP: GENERIC; PACK_TYPE: 0201; ROOM: NONE; TOLERANCE: 20%; VOLTAGE: 25V; OriginalSymbolOrigin: (-25,50); XY: (-4500,4950); VER: 2; ROT: 0; PHYS_PAGE: 72; LOCATION: C7203; DRAWING: @RVP1_ADL_SB_ADP_S_DDR5_SODIMM_2DPC_LIB.H55_DG2_2DPC(SCH_1):PAGE72; CDS_LIB: c_discrete; VARIANT: ?; PCB Footprint: CTK0_SM0201_630X330_MA; CDS_PART_NAME: C_CAP_0201-K27071-001,X5R,0.22UF,25V,20%,TK0,GENERIC; CDS_LOCATION: C7203
C7204 = C_CAP#1: PART_NUMBER: K27071-001; CHIPS_PART_NAME: C_CAP; CDS_PHYS_PART_NAME: C_CAP_0201-K27071-001,X5R,0.22UF,25V,20%,TK0,GENERIC; CDS_LMAN_SYM_OUTLINE: -50,50,50,-50; FP_TECH: TK0; IP: GENERIC; PACK_TYPE: 0201; ROOM: NONE; TOLERANCE: 20%; VOLTAGE: 25V; OriginalSymbolOrigin: (-25,50); XY: (-4500,4900); VER: 2; ROT: 0; PHYS_PAGE: 72; LOCATION: C7204; DRAWING: @RVP1_ADL_SB_ADP_S_DDR5_SODIMM_2DPC_LIB.H55_DG2_2DPC(SCH_1):PAGE72; CDS_LIB: c_discrete; VARIANT: ?; PCB Footprint: CTK0_SM0201_630X330_MA; CDS_PART_NAME: C_CAP_0201-K27071-001,X5R,0.22UF,25V,20%,TK0,GENERIC; CDS_LOCATION: C7204
C7205 = C_CAP#1: PART_NUMBER: K27071-001; CHIPS_PART_NAME: C_CAP; CDS_PHYS_PART_NAME: C_CAP_0201-K27071-001,X5R,0.22UF,25V,20%,TK0,GENERIC; CDS_LMAN_SYM_OUTLINE: -50,50,50,-50; FP_TECH: TK0; IP: GENERIC; PACK_TYPE: 0201; ROOM: NONE; TOLERANCE: 20%; VOLTAGE: 25V; OriginalSymbolOrigin: (-25,50); XY: (-4500,4575); VER: 2; ROT: 0; PHYS_PAGE: 72; LOCATION: C7205; DRAWING: @RVP1_ADL_SB_ADP_S_DDR5_SODIMM_2DPC_LIB.H55_DG2_2DPC(SCH_1):PAGE72; CDS_LIB: c_discrete; VARIANT: ?; PCB Footprint: CTK0_SM0201_630X330_MA; CDS_PART_NAME: C_CAP_0201-K27071-001,X5R,0.22UF,25V,20%,TK0,GENERIC; CDS_LOCATION: C7205
C7206 = C_CAP#1: PART_NUMBER: K27071-001; CHIPS_PART_NAME: C_CAP; CDS_PHYS_PART_NAME: C_CAP_0201-K27071-001,X5R,0.22UF,25V,20%,TK0,GENERIC; CDS_LMAN_SYM_OUTLINE: -50,50,50,-50; FP_TECH: TK0; IP: GENERIC; PACK_TYPE: 0201; ROOM: NONE; TOLERANCE: 20%; VOLTAGE: 25V; OriginalSymbolOrigin: (-25,50); XY: (-4500,4525); VER: 2; ROT: 0; PHYS_PAGE: 72; LOCATION: C7206; DRAWING: @RVP1_ADL_SB_ADP_S_DDR5_SODIMM_2DPC_LIB.H55_DG2_2DPC(SCH_1):PAGE72; CDS_LIB: c_discrete; VARIANT: ?; PCB Footprint: CTK0_SM0201_630X330_MA; CDS_PART_NAME: C_CAP_0201-K27071-001,X5R,0.22UF,25V,20%,TK0,GENERIC; CDS_LOCATION: C7206
C7207 = C_CAP#1: PART_NUMBER: K27071-001; CHIPS_PART_NAME: C_CAP; CDS_PHYS_PART_NAME: C_CAP_0201-K27071-001,X5R,0.22UF,25V,20%,TK0,GENERIC; CDS_LMAN_SYM_OUTLINE: -50,50,50,-50; FP_TECH: TK0; IP: GENERIC; PACK_TYPE: 0201; ROOM: NONE; TOLERANCE: 20%; VOLTAGE: 25V; OriginalSymbolOrigin: (-25,50); XY: (-4500,4275); VER: 2; ROT: 0; PHYS_PAGE: 72; LOCATION: C7207; DRAWING: @RVP1_ADL_SB_ADP_S_DDR5_SODIMM_2DPC_LIB.H55_DG2_2DPC(SCH_1):PAGE72; CDS_LIB: c_discrete; VARIANT: ?; PCB Footprint: CTK0_SM0201_630X330_MA; CDS_PART_NAME: C_CAP_0201-K27071-001,X5R,0.22UF,25V,20%,TK0,GENERIC; CDS_LOCATION: C7207
C7208 = C_CAP#1: PART_NUMBER: K27071-001; CHIPS_PART_NAME: C_CAP; CDS_PHYS_PART_NAME: C_CAP_0201-K27071-001,X5R,0.22UF,25V,20%,TK0,GENERIC; CDS_LMAN_SYM_OUTLINE: -50,50,50,-50; FP_TECH: TK0; IP: GENERIC; PACK_TYPE: 0201; ROOM: NONE; TOLERANCE: 20%; VOLTAGE: 25V; OriginalSymbolOrigin: (-25,50); XY: (-4500,4225); VER: 2; ROT: 0; PHYS_PAGE: 72; LOCATION: C7208; DRAWING: @RVP1_ADL_SB_ADP_S_DDR5_SODIMM_2DPC_LIB.H55_DG2_2DPC(SCH_1):PAGE72; CDS_LIB: c_discrete; VARIANT: ?; PCB Footprint: CTK0_SM0201_630X330_MA; CDS_PART_NAME: C_CAP_0201-K27071-001,X5R,0.22UF,25V,20%,TK0,GENERIC; CDS_LOCATION: C7208
C7209 = C_CAP#1: PART_NUMBER: K27071-001; CHIPS_PART_NAME: C_CAP; CDS_PHYS_PART_NAME: C_CAP_0201-K27071-001,X5R,0.22UF,25V,20%,TK0,GENERIC; CDS_LMAN_SYM_OUTLINE: -50,50,50,-50; FP_TECH: TK0; IP: GENERIC; PACK_TYPE: 0201; ROOM: NONE; TOLERANCE: 20%; VOLTAGE: 25V; OriginalSymbolOrigin: (-25,50); XY: (-4500,3950); VER: 2; ROT: 0; PHYS_PAGE: 72; LOCATION: C7209; DRAWING: @RVP1_ADL_SB_ADP_S_DDR5_SODIMM_2DPC_LIB.H55_DG2_2DPC(SCH_1):PAGE72; CDS_LIB: c_discrete; VARIANT: ?; PCB Footprint: CTK0_SM0201_630X330_MA; CDS_PART_NAME: C_CAP_0201-K27071-001,X5R,0.22UF,25V,20%,TK0,GENERIC; CDS_LOCATION: C7209
C7210 = C_CAP#1: PART_NUMBER: K27071-001; CHIPS_PART_NAME: C_CAP; CDS_PHYS_PART_NAME: C_CAP_0201-K27071-001,X5R,0.22UF,25V,20%,TK0,GENERIC; CDS_LMAN_SYM_OUTLINE: -50,50,50,-50; FP_TECH: TK0; IP: GENERIC; PACK_TYPE: 0201; ROOM: NONE; TOLERANCE: 20%; VOLTAGE: 25V; OriginalSymbolOrigin: (-25,50); XY: (-4500,3900); VER: 2; ROT: 0; PHYS_PAGE: 72; LOCATION: C7210; DRAWING: @RVP1_ADL_SB_ADP_S_DDR5_SODIMM_2DPC_LIB.H55_DG2_2DPC(SCH_1):PAGE72; CDS_LIB: c_discrete; VARIANT: ?; PCB Footprint: CTK0_SM0201_630X330_MA; CDS_PART_NAME: C_CAP_0201-K27071-001,X5R,0.22UF,25V,20%,TK0,GENERIC; CDS_LOCATION: C7210
C7211 = CAP#2: PART_NUMBER: K27071-001; CHIPS_PART_NAME: CAP; CDS_PHYS_PART_NAME: CAP_0201-K27071-001,X5R,0.22UF,25V,20%,LPDB,GENERIC; PACK_TYPE: 0201; TOLERANCE: 20%; VOLTAGE: 25V; OriginalSymbolOrigin: (-75,25); XY: (-8350,4600); VER: 4; ROT: 2; PHYS_PAGE: 72; LOCATION: C7211; IP: GENERIC; FP_TECH: LPDB; DRAWING: @RVP1_ADL_SB_ADP_S_DDR5_SODIMM_2DPC_LIB.H55_DG2_2DPC(SCH_1):PAGE72; CDS_LIB: discrete; PCB Footprint: SMC0201MB; CDS_PART_NAME: CAP_0201-K27071-001,X5R,0.22UF,25V,20%,LPDB,GENERIC; CDS_LOCATION: C7211; ASI_MODEL: K27071-001
C7212 = CAP#2: PART_NUMBER: K27071-001; CHIPS_PART_NAME: CAP; CDS_PHYS_PART_NAME: CAP_0201-K27071-001,X5R,0.22UF,25V,20%,LPDB,GENERIC; PACK_TYPE: 0201; TOLERANCE: 20%; VOLTAGE: 25V; OriginalSymbolOrigin: (-75,25); XY: (-8350,4550); VER: 4; ROT: 2; PHYS_PAGE: 72; LOCATION: C7212; IP: GENERIC; FP_TECH: LPDB; DRAWING: @RVP1_ADL_SB_ADP_S_DDR5_SODIMM_2DPC_LIB.H55_DG2_2DPC(SCH_1):PAGE72; CDS_LIB: discrete; PCB Footprint: SMC0201MB; CDS_PART_NAME: CAP_0201-K27071-001,X5R,0.22UF,25V,20%,LPDB,GENERIC; CDS_LOCATION: C7212; ASI_MODEL: K27071-001
C7213 = CAP#2: PART_NUMBER: K27071-001; CHIPS_PART_NAME: CAP; CDS_PHYS_PART_NAME: CAP_0201-K27071-001,X5R,0.22UF,25V,20%,LPDB,GENERIC; PACK_TYPE: 0201; TOLERANCE: 20%; VOLTAGE: 25V; OriginalSymbolOrigin: (-75,25); XY: (-8350,4275); VER: 4; ROT: 2; PHYS_PAGE: 72; LOCATION: C7213; IP: GENERIC; FP_TECH: LPDB; DRAWING: @RVP1_ADL_SB_ADP_S_DDR5_SODIMM_2DPC_LIB.H55_DG2_2DPC(SCH_1):PAGE72; CDS_LIB: discrete; PCB Footprint: SMC0201MB; CDS_PART_NAME: CAP_0201-K27071-001,X5R,0.22UF,25V,20%,LPDB,GENERIC; CDS_LOCATION: C7213; ASI_MODEL: K27071-001
C7214 = CAP#2: PART_NUMBER: K27071-001; CHIPS_PART_NAME: CAP; CDS_PHYS_PART_NAME: CAP_0201-K27071-001,X5R,0.22UF,25V,20%,LPDB,GENERIC; PACK_TYPE: 0201; TOLERANCE: 20%; VOLTAGE: 25V; OriginalSymbolOrigin: (-75,25); XY: (-8350,4225); VER: 4; ROT: 2; PHYS_PAGE: 72; LOCATION: C7214; IP: GENERIC; FP_TECH: LPDB; DRAWING: @RVP1_ADL_SB_ADP_S_DDR5_SODIMM_2DPC_LIB.H55_DG2_2DPC(SCH_1):PAGE72; CDS_LIB: discrete; PCB Footprint: SMC0201MB; CDS_PART_NAME: CAP_0201-K27071-001,X5R,0.22UF,25V,20%,LPDB,GENERIC; CDS_LOCATION: C7214; ASI_MODEL: K27071-001
C7215 = CAP#2: PART_NUMBER: K27071-001; CHIPS_PART_NAME: CAP; CDS_PHYS_PART_NAME: CAP_0201-K27071-001,X5R,0.22UF,25V,20%,LPDB,GENERIC; PACK_TYPE: 0201; TOLERANCE: 20%; VOLTAGE: 25V; OriginalSymbolOrigin: (-75,25); XY: (-8350,3950); VER: 4; ROT: 2; PHYS_PAGE: 72; LOCATION: C7215; IP: GENERIC; FP_TECH: LPDB; DRAWING: @RVP1_ADL_SB_ADP_S_DDR5_SODIMM_2DPC_LIB.H55_DG2_2DPC(SCH_1):PAGE72; CDS_LIB: discrete; PCB Footprint: SMC0201MB; CDS_PART_NAME: CAP_0201-K27071-001,X5R,0.22UF,25V,20%,LPDB,GENERIC; CDS_LOCATION: C7215; ASI_MODEL: K27071-001
C7216 = CAP#2: PART_NUMBER: K27071-001; CHIPS_PART_NAME: CAP; CDS_PHYS_PART_NAME: CAP_0201-K27071-001,X5R,0.22UF,25V,20%,LPDB,GENERIC; PACK_TYPE: 0201; TOLERANCE: 20%; VOLTAGE: 25V; OriginalSymbolOrigin: (-75,25); XY: (-8350,3900); VER: 4; ROT: 2; PHYS_PAGE: 72; LOCATION: C7216; IP: GENERIC; FP_TECH: LPDB; DRAWING: @RVP1_ADL_SB_ADP_S_DDR5_SODIMM_2DPC_LIB.H55_DG2_2DPC(SCH_1):PAGE72; CDS_LIB: discrete; PCB Footprint: SMC0201MB; CDS_PART_NAME: CAP_0201-K27071-001,X5R,0.22UF,25V,20%,LPDB,GENERIC; CDS_LOCATION: C7216; ASI_MODEL: K27071-001

## Sheet 0073_HSIO MUXING -4.SchDoc
size 848 x 558 mm
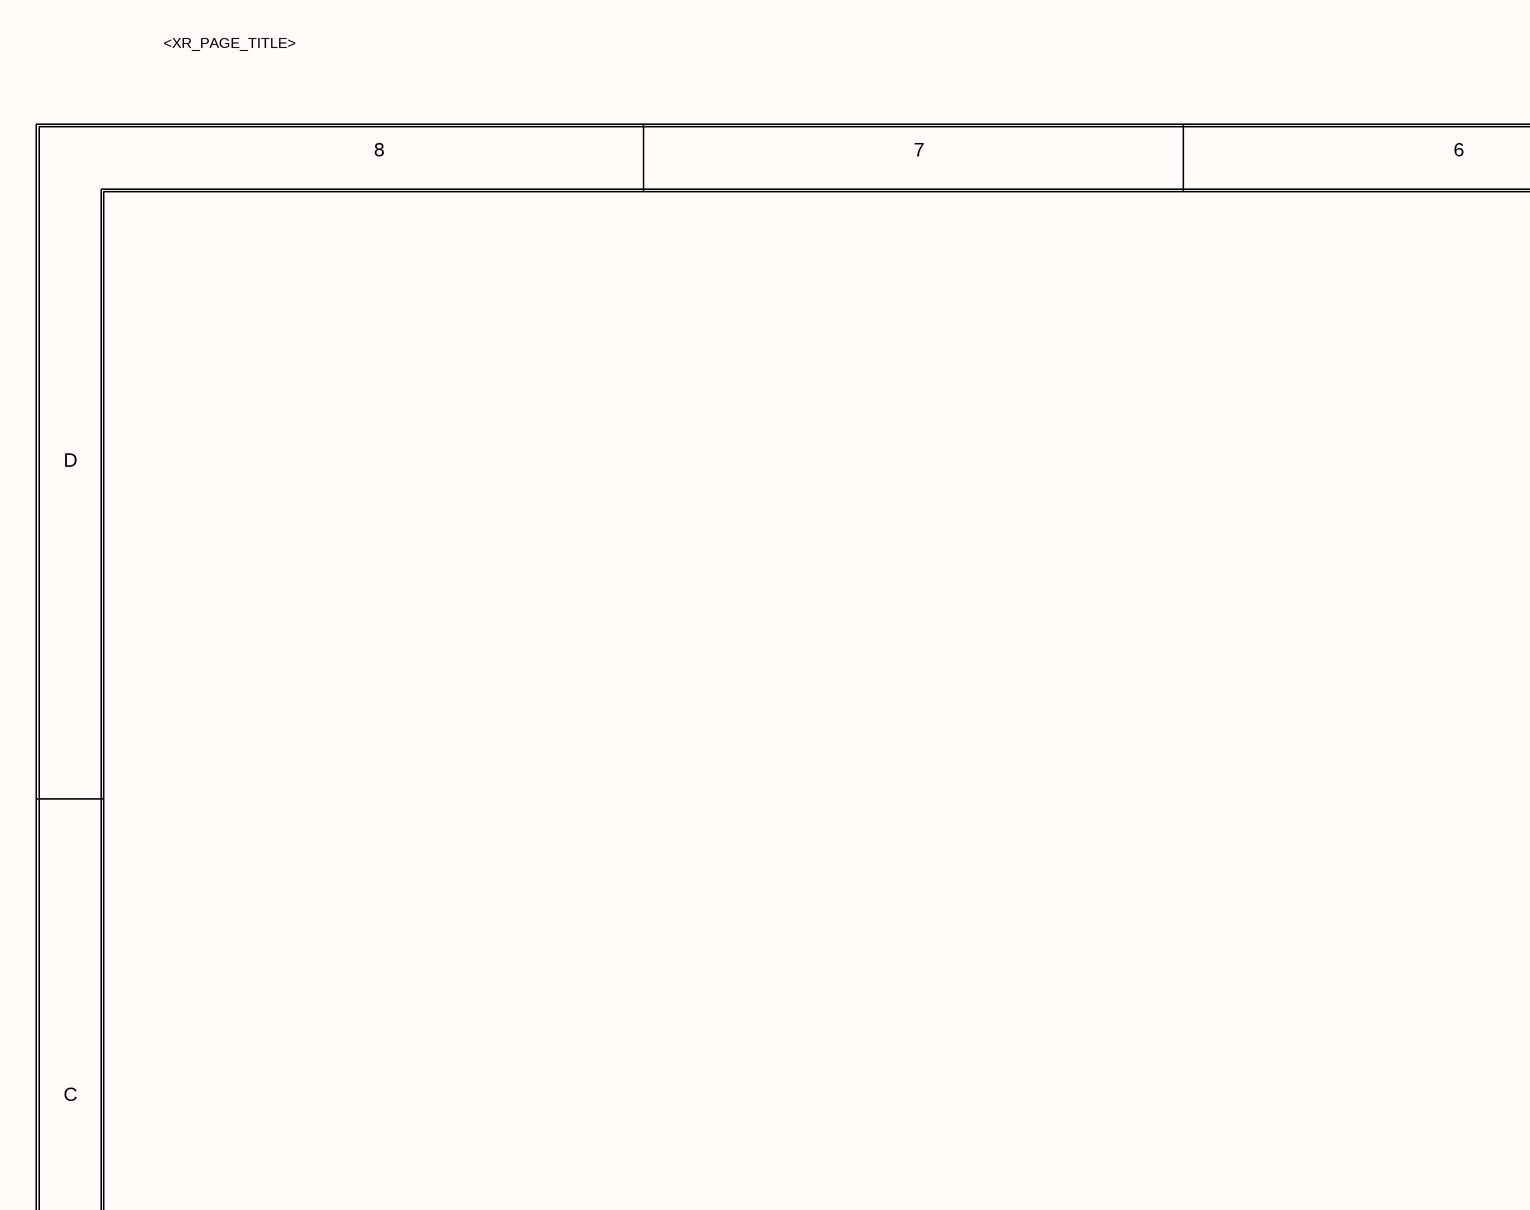
[diagram p116: 0073_HSIO MUXING -4.SchDoc, top left]
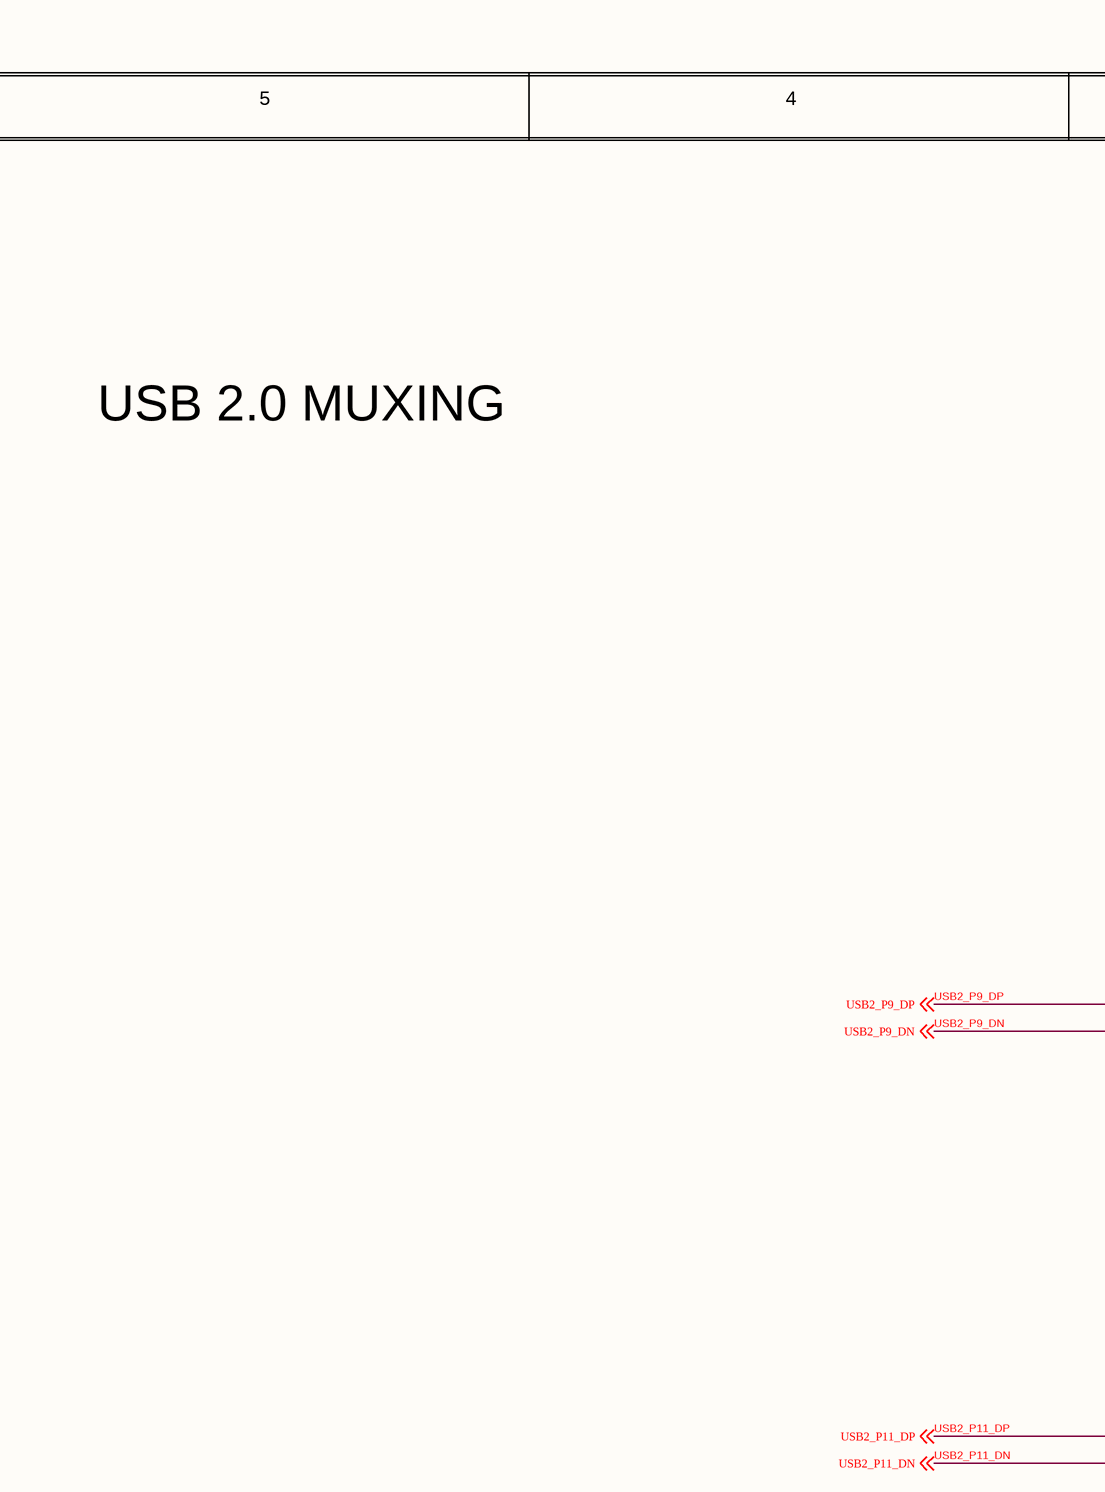
[diagram p117: 0073_HSIO MUXING -4.SchDoc, top middle]
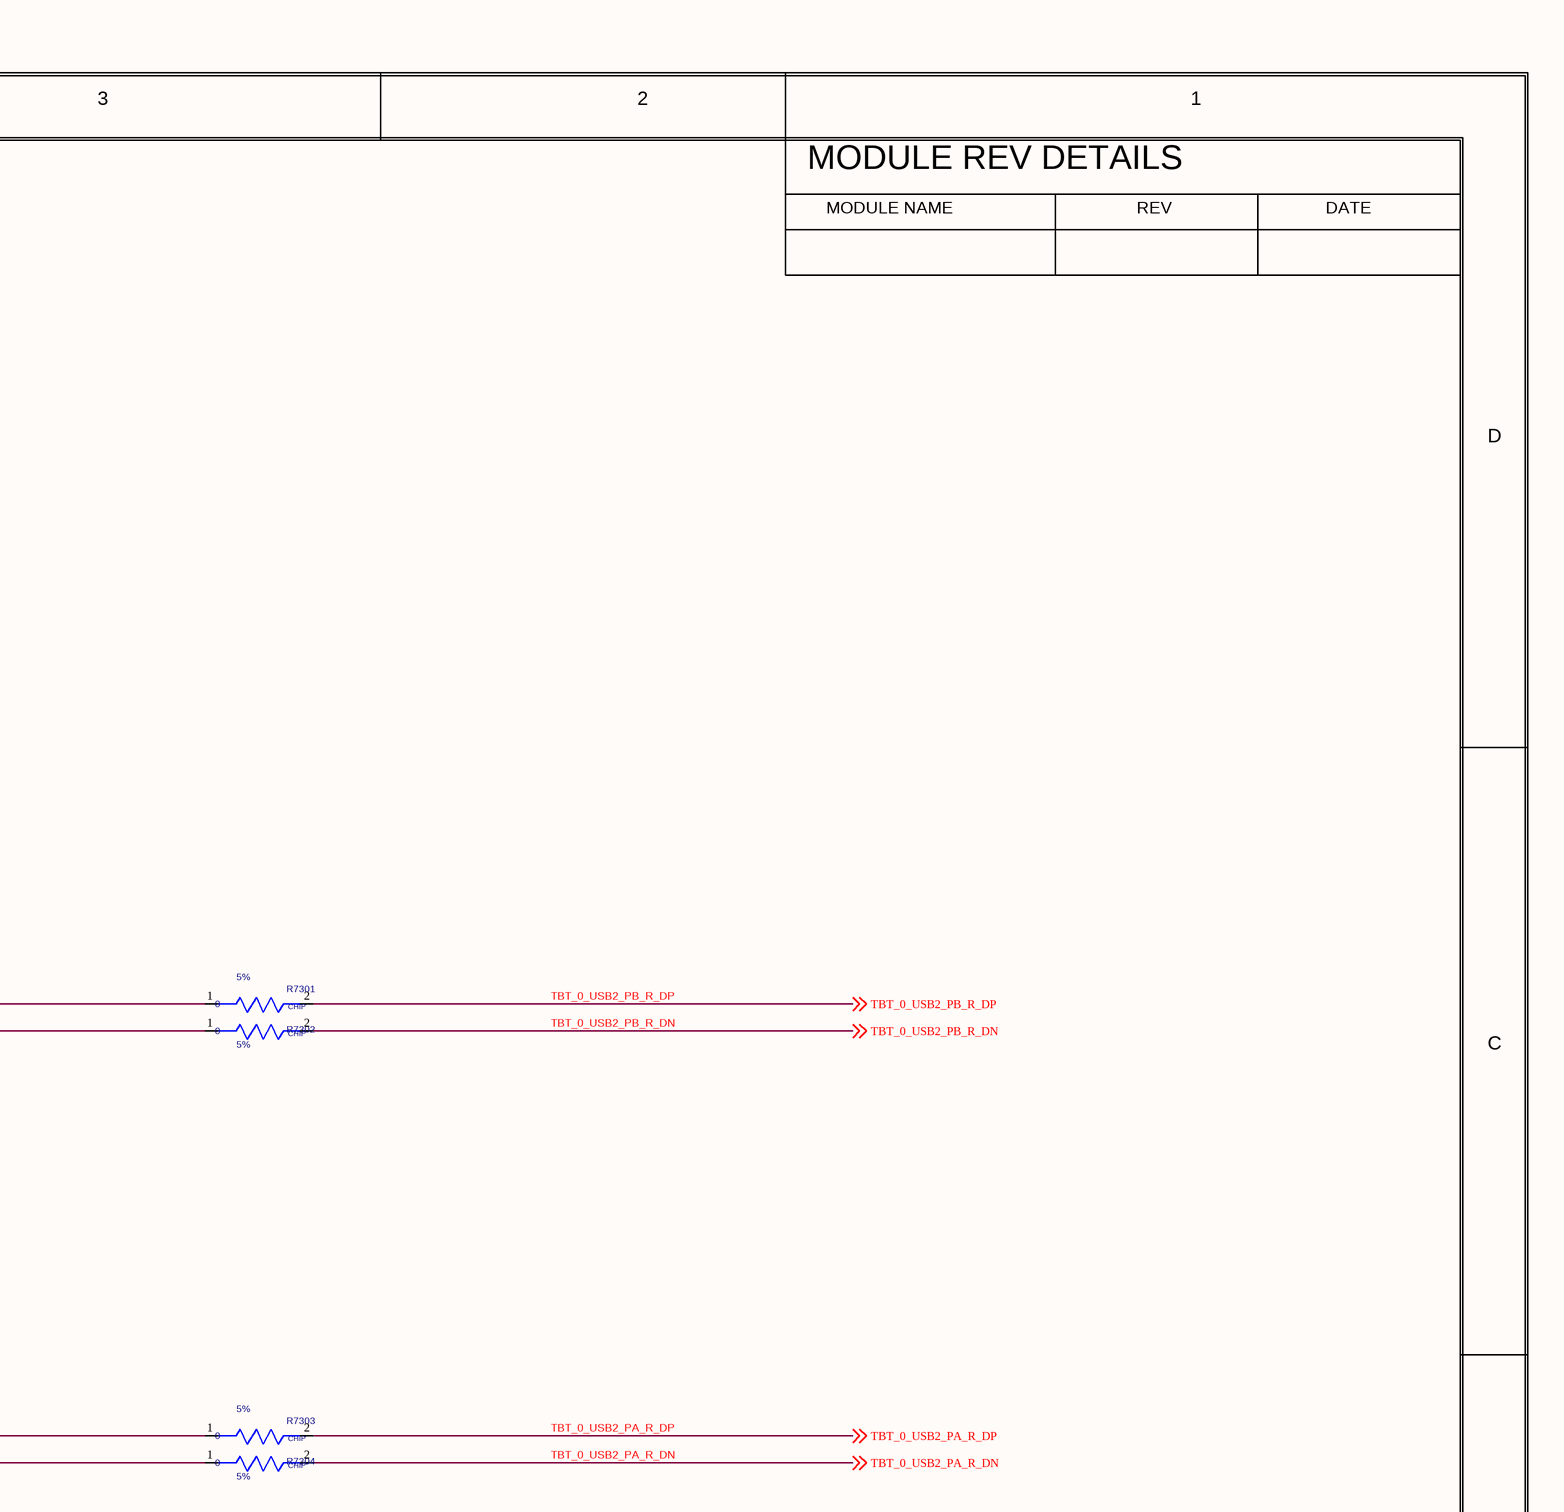
[diagram p118: 0073_HSIO MUXING -4.SchDoc, top right]
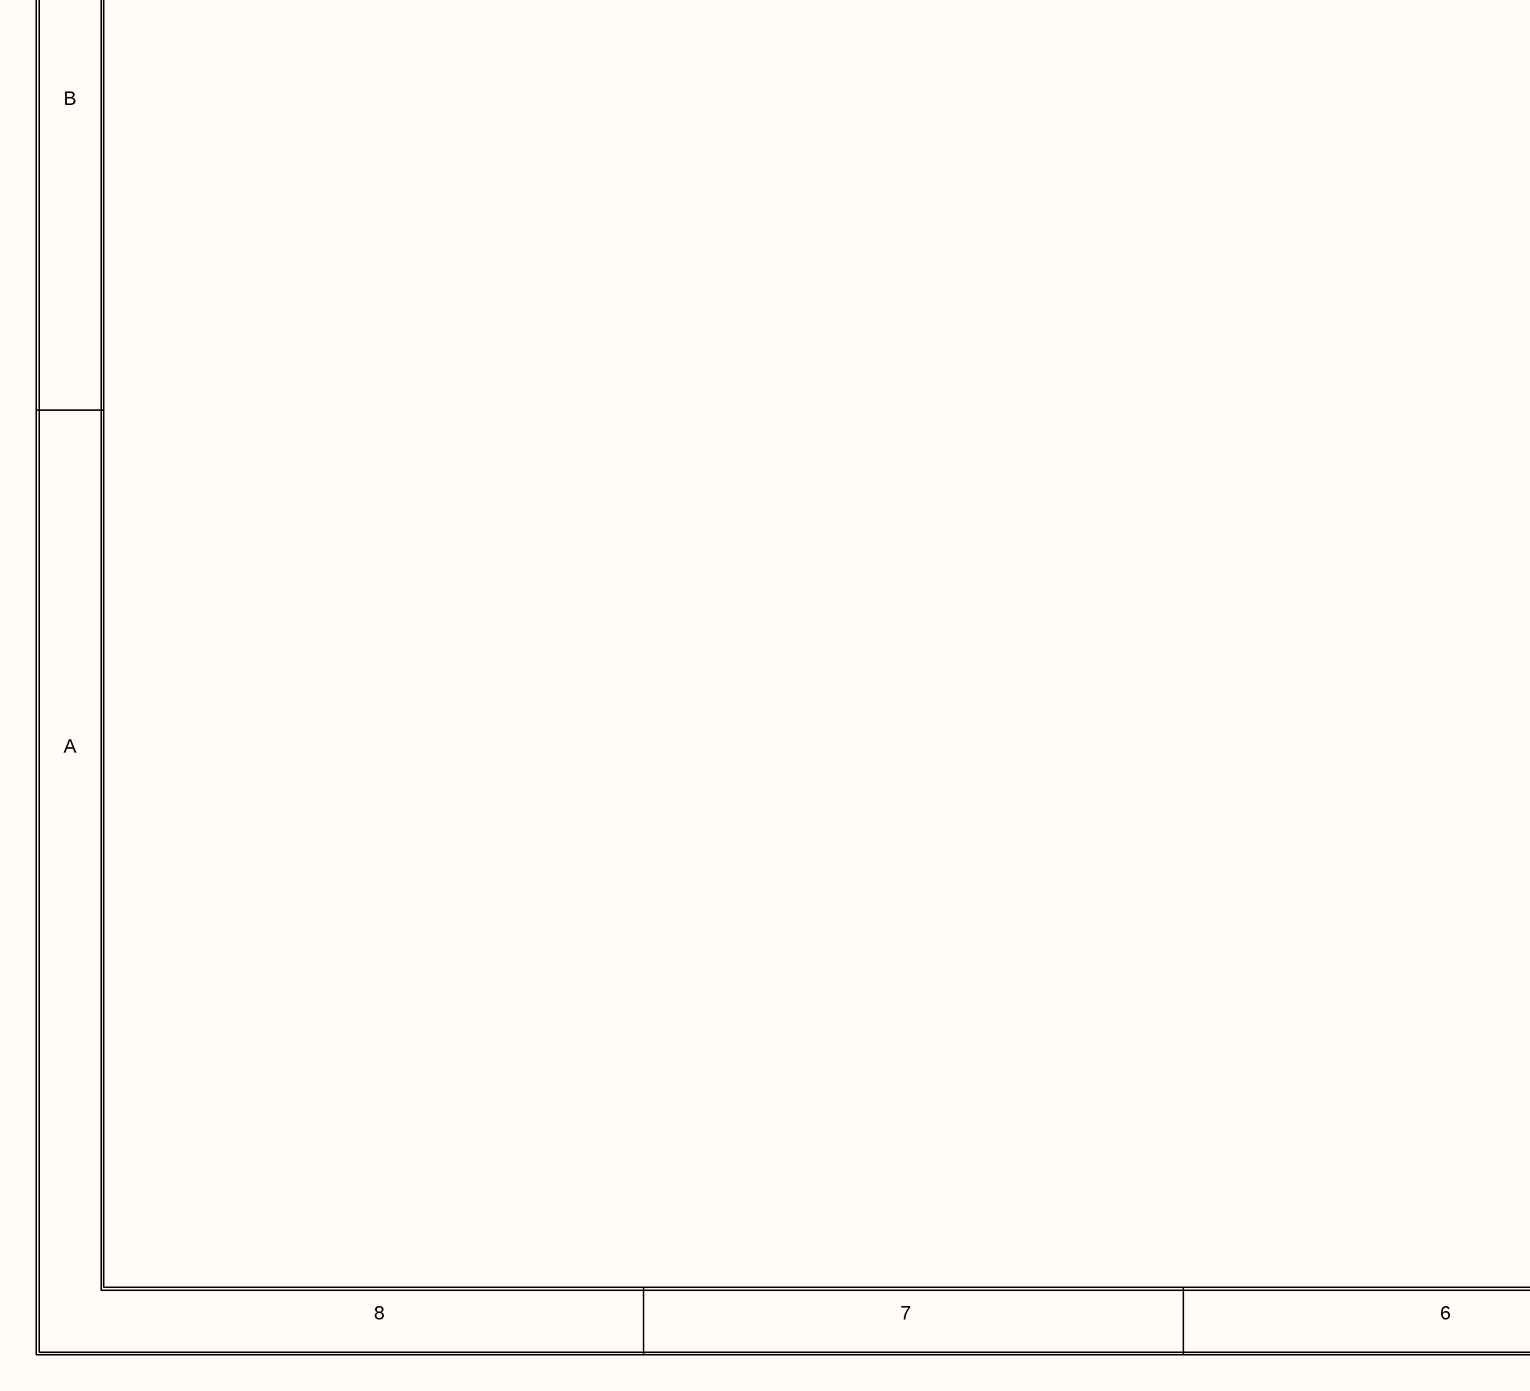
[diagram p119: 0073_HSIO MUXING -4.SchDoc, bottom left]
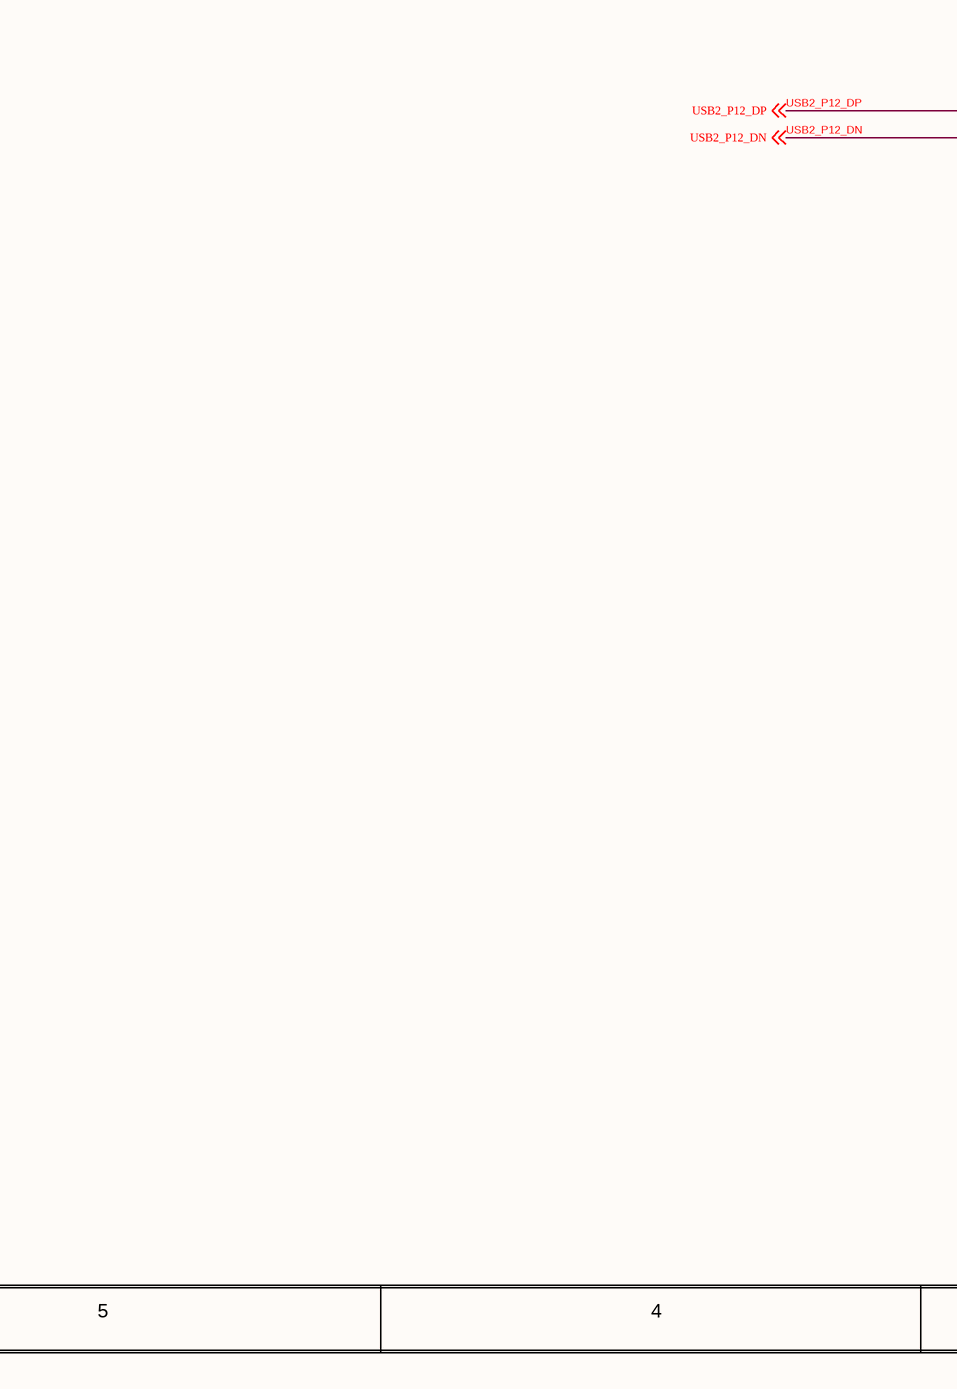
[diagram p120: 0073_HSIO MUXING -4.SchDoc, bottom middle]
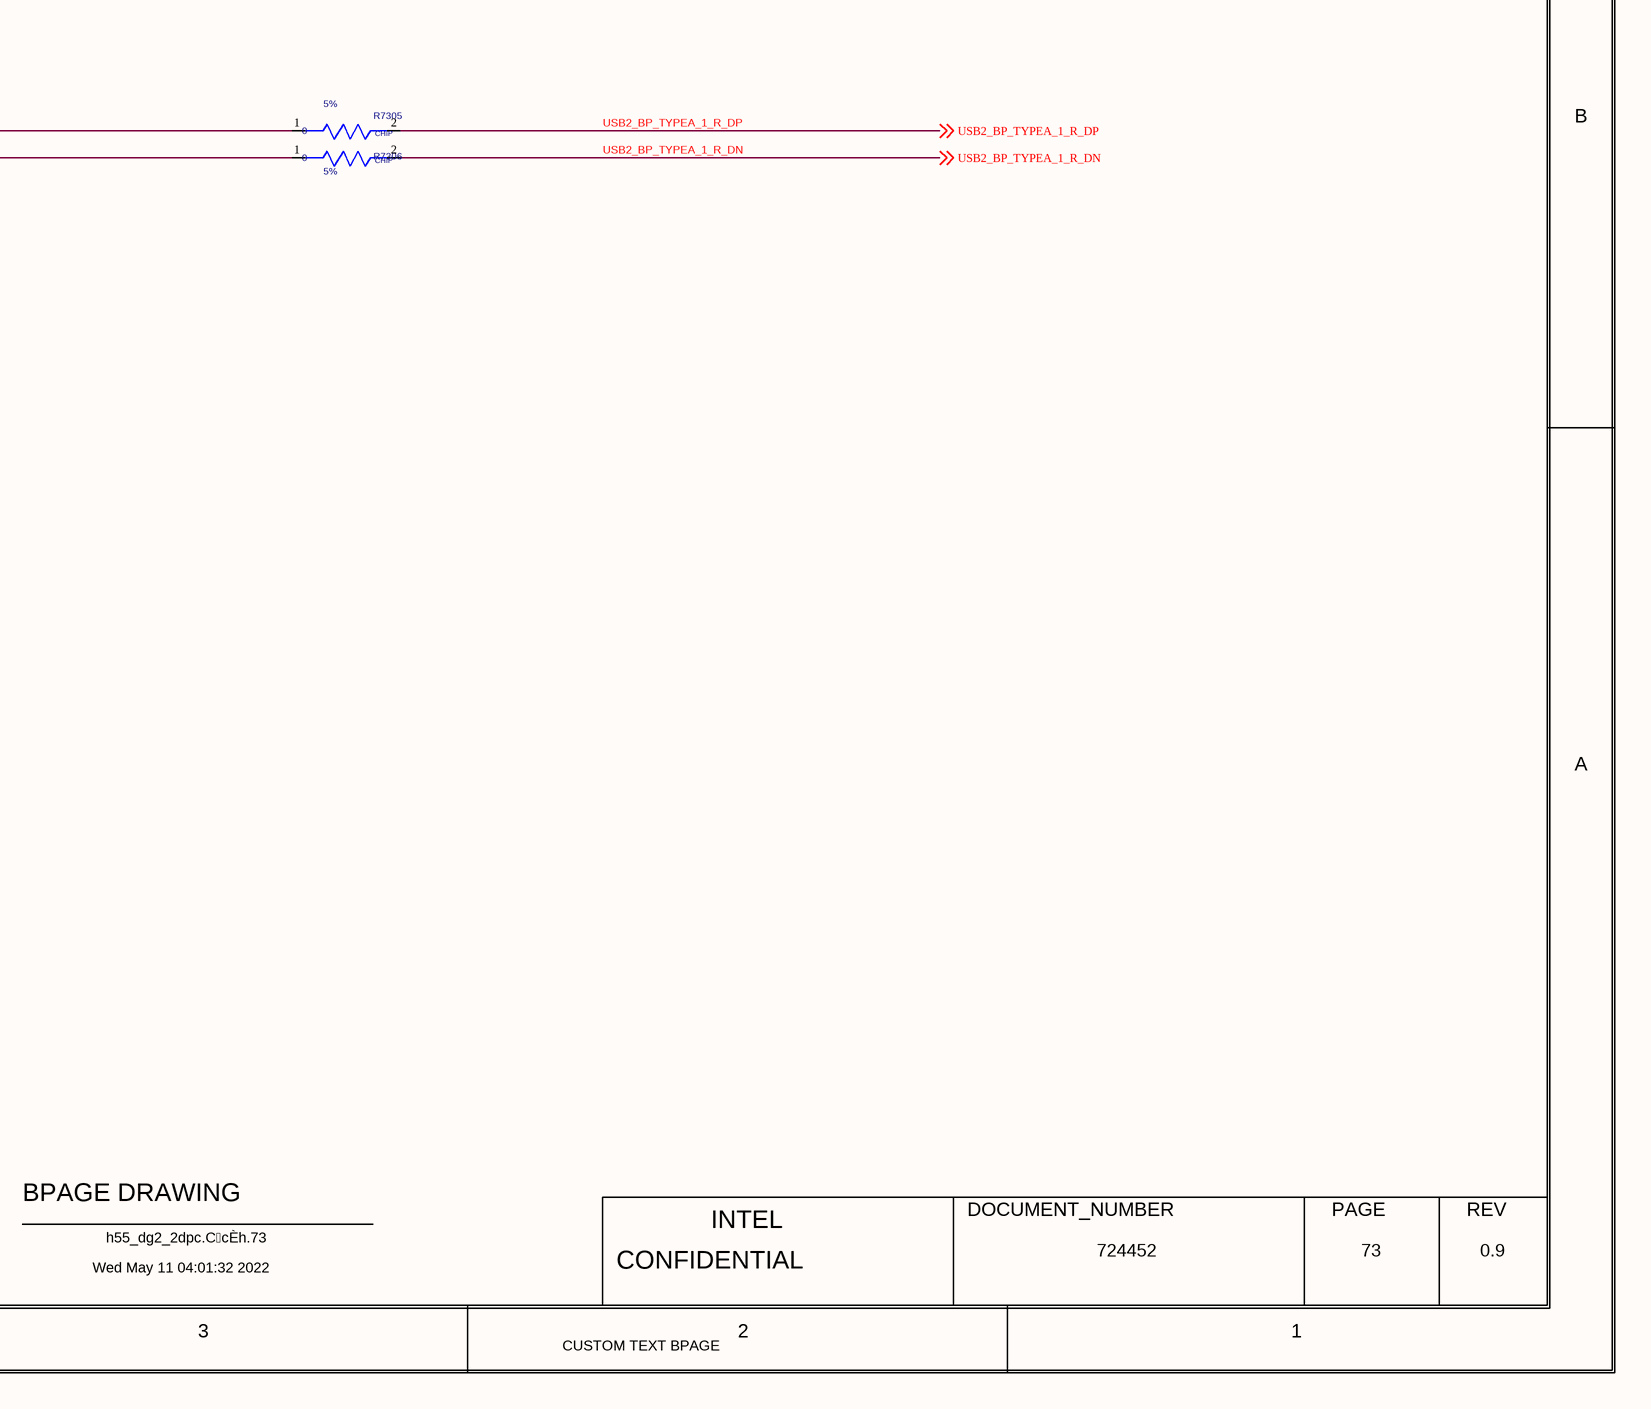
[diagram p121: 0073_HSIO MUXING -4.SchDoc, bottom right]

### Parts
R7301  0  MATERIAL: CHIP  TOLERANCE: 5%  [SMR0402IA]
R7302  0  MATERIAL: CHIP  TOLERANCE: 5%  [SMR0402IA]
R7303  0  MATERIAL: CHIP  TOLERANCE: 5%  [SMR0402IA]
R7304  0  MATERIAL: CHIP  TOLERANCE: 5%  [SMR0402IA]
R7305  0  MATERIAL: CHIP  TOLERANCE: 5%  [SMR0402IA]
R7306  0  MATERIAL: CHIP  TOLERANCE: 5%  [SMR0402IA]

### Nets
TBT_0_USB2_PA_R_DN: R7304.2(B) ; off-sheet TBT_0_USB2_PA_R_DN
TBT_0_USB2_PA_R_DP: R7303.2(B) ; off-sheet TBT_0_USB2_PA_R_DP
TBT_0_USB2_PB_R_DN: R7302.2(B) ; off-sheet TBT_0_USB2_PB_R_DN
TBT_0_USB2_PB_R_DP: R7301.2(B) ; off-sheet TBT_0_USB2_PB_R_DP
USB2_BP_TYPEA_1_R_DN: R7306.2(B) ; off-sheet USB2_BP_TYPEA_1_R_DN
USB2_BP_TYPEA_1_R_DP: R7305.2(B) ; off-sheet USB2_BP_TYPEA_1_R_DP
USB2_P9_DN: R7302.1(A) ; off-sheet USB2_P9_DN
USB2_P9_DP: R7301.1(A) ; off-sheet USB2_P9_DP
USB2_P11_DN: R7304.1(A) ; off-sheet USB2_P11_DN
USB2_P11_DP: R7303.1(A) ; off-sheet USB2_P11_DP
USB2_P12_DN: R7306.1(A) ; off-sheet USB2_P12_DN
USB2_P12_DP: R7305.1(A) ; off-sheet USB2_P12_DP

### Notes on the sheet
- <XR_PAGE_TITLE>
- 8
- 7
- 6
- 5
- 4
- 3
- 2
- 1
- MODULE REV DETAILS
- MODULE NAME
- REV
- DATE
- D
- USB 2.0 MUXING
- C
- B
- A
- BPAGE DRAWING
- INTEL
- DOCUMENT_NUMBER
- PAGE
- Wed May 11 04:01:32 2022
- h55_dg2_2dpc.CcÈh.73
- CONFIDENTIAL
- 724452
- 73
- 0.9
- CUSTOM TEXT BPAGE

### Library data of the parts
R7301 = RES#1: PART_NUMBER: A93549-001; CHIPS_PART_NAME: RES; CDS_PHYS_PART_NAME: RES_0402-A93549-001,CHIP,0,5%,1/16W,LPDB,GENERIC; PACK_TYPE: 0402; WATTAGE: 1/16W; OriginalSymbolOrigin: (-75,25); XY: (-2225,3400); VER: 1; PHYS_PAGE: 73; LOCATION: R7301; DRAWING: @RVP1_ADL_SB_ADP_S_DDR5_SODIMM_2DPC_LIB.H55_DG2_2DPC(SCH_1):PAGE73; CDS_LIB: discrete; PCB Footprint: SMR0402IA; SEC_TYPE: 0402; ROT: 0; CDS_PART_NAME: RES_0402-A93549-001,CHIP,0,5%,1/16W,LPDB,GENERIC; CDS_LOCATION: R7301; ASI_MODEL: A93549-001
R7302 = RES#1: PART_NUMBER: A93549-001; CHIPS_PART_NAME: RES; CDS_PHYS_PART_NAME: RES_0402-A93549-001,CHIP,0,5%,1/16W,LPDB,GENERIC; PACK_TYPE: 0402; WATTAGE: 1/16W; OriginalSymbolOrigin: (-75,25); XY: (-2225,3350); VER: 1; PHYS_PAGE: 73; LOCATION: R7302; DRAWING: @RVP1_ADL_SB_ADP_S_DDR5_SODIMM_2DPC_LIB.H55_DG2_2DPC(SCH_1):PAGE73; CDS_LIB: discrete; PCB Footprint: SMR0402IA; SEC_TYPE: 0402; ROT: 0; CDS_PART_NAME: RES_0402-A93549-001,CHIP,0,5%,1/16W,LPDB,GENERIC; CDS_LOCATION: R7302; ASI_MODEL: A93549-001
R7303 = RES#1: PART_NUMBER: A93549-001; CHIPS_PART_NAME: RES; CDS_PHYS_PART_NAME: RES_0402-A93549-001,CHIP,0,5%,1/16W,LPDB,GENERIC; PACK_TYPE: 0402; WATTAGE: 1/16W; OriginalSymbolOrigin: (-75,25); XY: (-2225,2600); VER: 1; PHYS_PAGE: 73; LOCATION: R7303; DRAWING: @RVP1_ADL_SB_ADP_S_DDR5_SODIMM_2DPC_LIB.H55_DG2_2DPC(SCH_1):PAGE73; CDS_LIB: discrete; PCB Footprint: SMR0402IA; SEC_TYPE: 0402; ROT: 0; CDS_PART_NAME: RES_0402-A93549-001,CHIP,0,5%,1/16W,LPDB,GENERIC; CDS_LOCATION: R7303; ASI_MODEL: A93549-001
R7304 = RES#1: PART_NUMBER: A93549-001; CHIPS_PART_NAME: RES; CDS_PHYS_PART_NAME: RES_0402-A93549-001,CHIP,0,5%,1/16W,LPDB,GENERIC; PACK_TYPE: 0402; WATTAGE: 1/16W; OriginalSymbolOrigin: (-75,25); XY: (-2225,2550); VER: 1; PHYS_PAGE: 73; LOCATION: R7304; DRAWING: @RVP1_ADL_SB_ADP_S_DDR5_SODIMM_2DPC_LIB.H55_DG2_2DPC(SCH_1):PAGE73; CDS_LIB: discrete; PCB Footprint: SMR0402IA; SEC_TYPE: 0402; ROT: 0; CDS_PART_NAME: RES_0402-A93549-001,CHIP,0,5%,1/16W,LPDB,GENERIC; CDS_LOCATION: R7304; ASI_MODEL: A93549-001
R7305 = RES#1: PART_NUMBER: A93549-001; CHIPS_PART_NAME: RES; CDS_PHYS_PART_NAME: RES_0402-A93549-001,CHIP,0,5%,1/16W,LPDB,GENERIC; PACK_TYPE: 0402; WATTAGE: 1/16W; OriginalSymbolOrigin: (-75,25); XY: (-2225,2175); VER: 1; PHYS_PAGE: 73; LOCATION: R7305; DRAWING: @RVP1_ADL_SB_ADP_S_DDR5_SODIMM_2DPC_LIB.H55_DG2_2DPC(SCH_1):PAGE73; CDS_LIB: discrete; PCB Footprint: SMR0402IA; SEC_TYPE: 0402; ROT: 0; CDS_PART_NAME: RES_0402-A93549-001,CHIP,0,5%,1/16W,LPDB,GENERIC; CDS_LOCATION: R7305; ASI_MODEL: A93549-001
R7306 = RES#1: PART_NUMBER: A93549-001; CHIPS_PART_NAME: RES; CDS_PHYS_PART_NAME: RES_0402-A93549-001,CHIP,0,5%,1/16W,LPDB,GENERIC; PACK_TYPE: 0402; WATTAGE: 1/16W; OriginalSymbolOrigin: (-75,25); XY: (-2225,2125); VER: 1; PHYS_PAGE: 73; LOCATION: R7306; DRAWING: @RVP1_ADL_SB_ADP_S_DDR5_SODIMM_2DPC_LIB.H55_DG2_2DPC(SCH_1):PAGE73; CDS_LIB: discrete; PCB Footprint: SMR0402IA; SEC_TYPE: 0402; ROT: 0; CDS_PART_NAME: RES_0402-A93549-001,CHIP,0,5%,1/16W,LPDB,GENERIC; CDS_LOCATION: R7306; ASI_MODEL: A93549-001